# Altium project STM32F4x1-N40-EVAL.PrjPcb
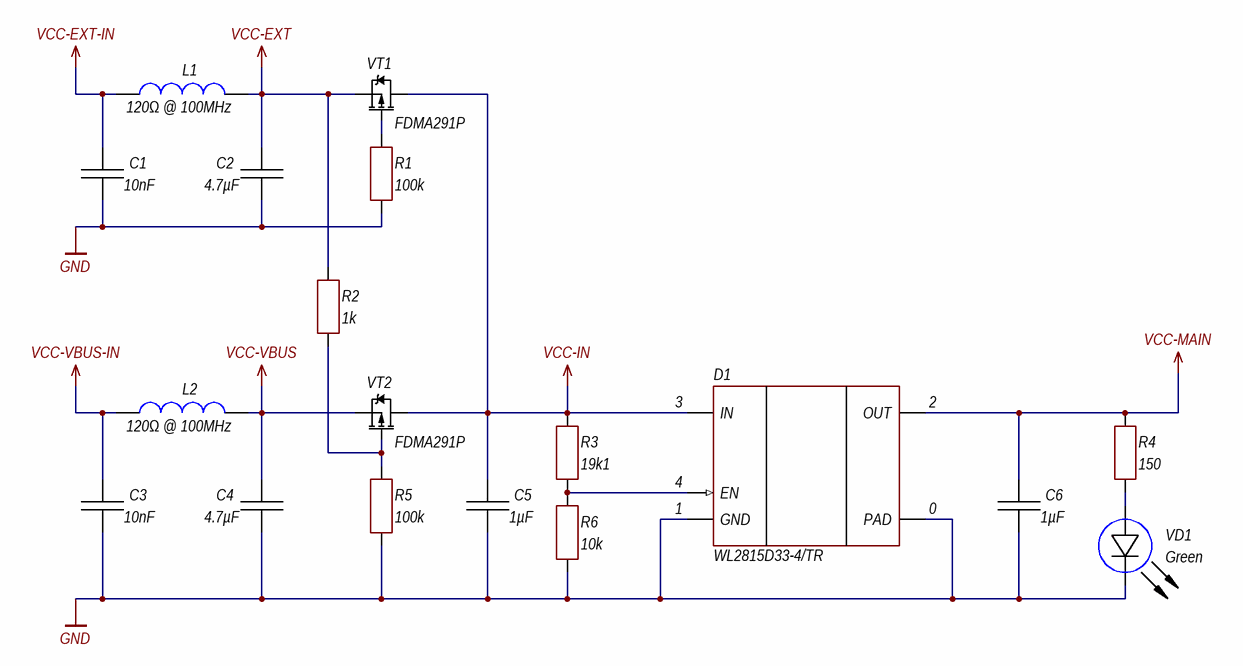
[diagram p0: Power Supply.SchDoc]
ProjectTitle: Eval board for STM32F4x1 MCU's in 48-UFQFPN package; ProjectShortDate: 2021.08; ProjectRevision: 0.1.5.1; ProjectNumber: STM32F411-N40-EVAL; ProjectDate: 29.08.2021; ProjectCompanyName: Azek Clark © 2021; ProjectAuthor: Clark A.
18 sheets, 167 parts. Net scope: flat (ports and power ports of the same name join across sheets).
Board file: PCB.PcbDoc
Sheets:
  Power Supply.SchDoc
  MCU-Power.SchDoc
  MCU-IO.SchDoc
  MCU-Debug.SchDoc
  GPIO-I2C.SchDoc
  GPIO-USB.SchDoc
  GPIO-SDIO.SchDoc
  GPIO-Debug.SchDoc
  USB-C-Control.SchDoc
  I2C-EEPROM.SchDoc
  I2C-Temp-sensor.SchDoc
  I2C-Motion-sensor.SchDoc
  I2C-Magnetometer-sensor.SchDoc
  Connector-Side-1.SchDoc
  Connector-Side-2.SchDoc
  Connector-USB.SchDoc
  Connector-SDCard.SchDoc
  LED&Button.SchDoc

## Sheet Power Supply.SchDoc: =ProjectTitle
size 297 x 209 mm; Author: Clark A.; CompanyName: Azek Clark © 2021; Address1: Address1; Address2: Address2; Address3: Address3; Address4: Address4; DocumentNumber: STM32F411-N40-EVAL-0.1.5.1; SheetNumber: 1; SheetTotal: 16; Scale: 1:1; DocumentType: Схема электрическая принципиальная; FirstReferrence: STM32F411-N40-EVAL

### Parts
C1  10nF  [CH0805CM]
C2  4.7µF  [CH0805CM]
C3  10nF  [CH0805CM]
C4  4.7µF  [CH0805CM]
C5  1µF  [CH0402C]
C6  1µF  [CH0402C]
D1  WL2815D33-4/TR  [DFN1010-4]
L1  120Ω @ 100MHz  [CH0805LM]
L2  120Ω @ 100MHz  [CH0805LM]
R1  100k  [CH0402R]
R2  1k  [CH0402R]
R3  19k1  [CH0402R]
R4  150  [CH0402R]
R5  100k  [CH0402R]
R6  10k  [CH0402R]
VD1  Green  [CH0402LG]
VT1  FDMA291P  [MicroFET 2x2]
VT2  FDMA291P  [MicroFET 2x2]

### Nets
GND: C1.1 C2.1 C3.1 C4.1 C5.1 C6.1 D1.0(PAD) D1.1(GND) R1.1 R5.1 R6.1 VD1.2(C)
VCC-EXT: C2.2 L1.1 R2.2 VT1.3(S)
VCC-EXT-IN: C1.2 L1.2
VCC-IN: C5.2 D1.3(IN) R3.2 VT1.2(D) VT2.2(D)
VCC-MAIN: C6.2 D1.2(OUT) R4.2
VCC-VBUS: C4.2 L2.1 VT2.3(S)
VCC-VBUS-IN: C3.2 L2.2
NetD1_4: D1.4(EN) R3.1 R6.2
NetR1_2: R1.2 VT1.1(G)
NetR2_1: R2.1 R5.2 VT2.1(G)
NetR4_1: R4.1 VD1.1(A)

### Notes on the sheet
- Утв.
- Н.контр.
- Т.контр.
- Пров.
- Разраб.
- Изм.
- Лист
- № докум.
- Подп.
- Дата
- Копировал
- Формат А4
- Лит.
- Листов
- Масса
- Масштаб

### Library data of the parts
C1-C6 = Capacitor: Manufacturer: *; Model: *; HelpURL: *; ComponentKind: *
  C1 C3: Value: 10nF
  C2 C4: Value: 4.7µF
  C5 C6: Value: 1µF
D1 = WL2815: LDO; Model: WL2815D33-4/TR; HelpURL: https://www.lcsc.com/product-detail/Linear-Voltage-Regulators-LDO_WILLSEMI-Will-Semicon-WL2815D33-4-TR_C506126.html; ComponentKind: DFN1010-4, 5.25V, 300mA
L1 L2 = Inductor: Manufacturer: *; Model: *; HelpURL: *; ComponentKind: *; Value: 120Ω @ 100MHz
R1-R6 = Resistor: Manufacturer: *; Model: *; HelpURL: *; ComponentKind: *
  R1 R5: Value: 100k
  R2: Value: 1k
  R3: Value: 19k1
  R4: Value: 150
  R6: Value: 10k
VD1 = LED: Manufacturer: *; Model: *; HelpURL: *; ComponentKind: *; Value: Green
VT1 VT2 = P-chanel: Mosfet; pin to pad: 1>3 2>1 3>2; Manufacturer: Fairchild Semiconductor; Model: FDMA291P; ComponentKind: -20V, -1V, 6.6A; HelpURL: https://www.chipdip.ru/product/fdma291p

## Sheet MCU-Power.SchDoc: =ProjectTitle
size 297 x 209 mm; Author: Clark A.; CompanyName: Azek Clark © 2021; Address1: Address1; Address2: Address2; Address3: Address3; Address4: Address4; DocumentNumber: STM32F411-N40-EVAL 0.1.5.1; SheetNumber: 2; SheetTotal: 16; Scale: 1:1; DocumentType: Схема электрическая принципиальная; FirstReferrence: STM32F411-N40-EVAL
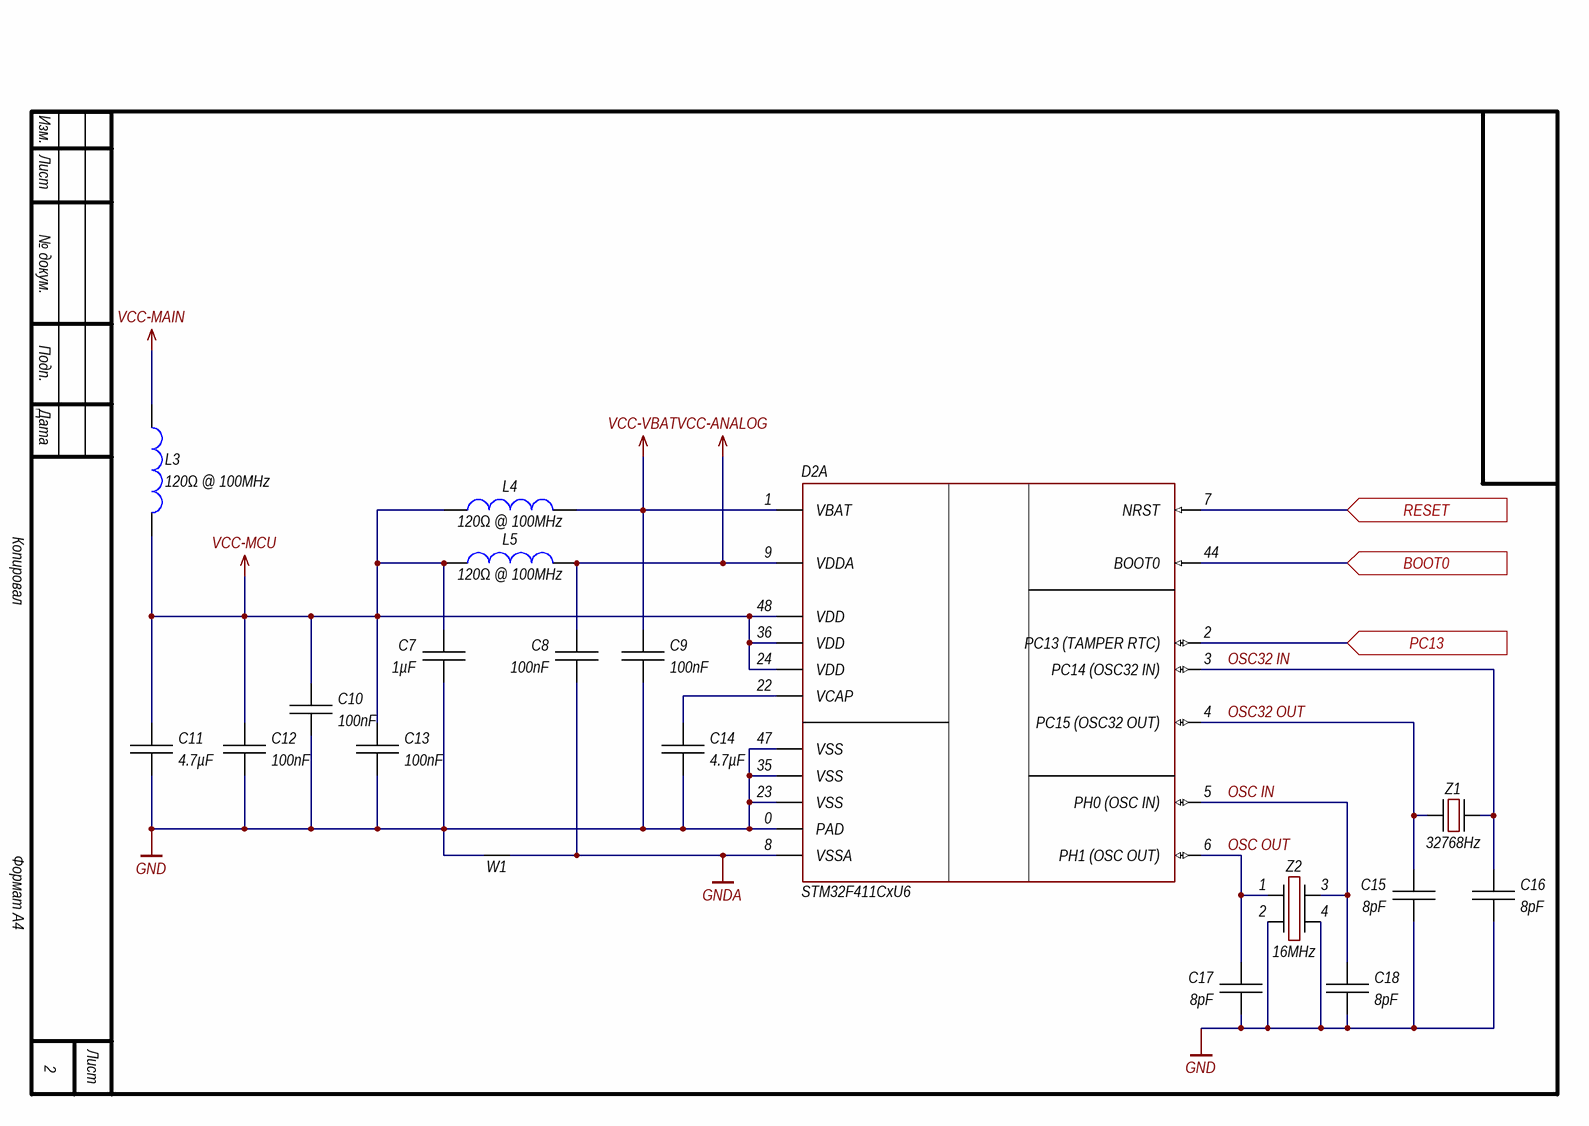
[diagram p1: MCU-Power.SchDoc]

### Parts
C7  1µF  [CH0402C]
C8  100nF  [CH0402C]
C9  100nF  [CH0402C]
C10  100nF  [CH0402C]
C11  4.7µF  [CH0402C]
C12  100nF  [CH0402C]
C13  100nF  [CH0402C]
C14  4.7µF  [CH0402C]
C15  8pF  [CH0402C]
C16  8pF  [CH0402C]
C17  8pF  [CH0402C]
C18  8pF  [CH0402C]
D2  STM32F411CxU6  [48-UFQFPN]  (part A of 2)
L3  120Ω @ 100MHz  [CH0402L]
L4  120Ω @ 100MHz  [CH0402L]
L5  120Ω @ 100MHz  [CH0402L]
W1  Net Tie  [CON: Net Tie 1.1x0.5]  (value not drawn)  (net tie, no BOM)
Z1  32768Hz  [OSC: 2012]
Z2  16MHz  [OSC: 2520]

### Ports
BOOT0 (in), PC13 (in), RESET (in)

### Nets
GND: C7.1 C9.1 C10.1 C11.1 C12.1 C13.1 C14.1 C15.1 C16.1 C17.1 C18.1 D2.0(PAD) D2.23(VSS) D2.35(VSS) D2.47(VSS) W1.1 Z2.2 Z2.4
GNDA: C8.1 D2.8(VSSA) W1.2
VCC-ANALOG: C8.2 D2.9(VDDA) L5.1
VCC-MAIN: L3.2
VCC-MCU: C7.2 C10.2 C11.2 C12.2 C13.2 D2.24(VDD) D2.36(VDD) D2.48(VDD) L3.1 L4.2 L5.2
VCC-VBAT: C9.2 D2.1(VBAT) L4.1
BOOT0: D2.44(BOOT0) ; port BOOT0
OSC32 IN: C16.2 D2.3(PC14_(OSC32_IN)) Z1.3
OSC32 OUT: C15.2 D2.4(PC15_(OSC32_OUT)) Z1.1
OSC IN: C18.2 D2.5(PH0_(OSC_IN)) Z2.3
OSC OUT: C17.2 D2.6(PH1_(OSC_OUT)) Z2.1
PC13: D2.2(PC13_(TAMPER_RTC)) ; port PC13
RESET: D2.7(NRST) ; port RESET
NetC14_2: C14.2 D2.22(VCAP)

### Notes on the sheet
- Изм.
- Лист
- № докум.
- Подп.
- Дата
- Копировал
- Формат А4

### Library data of the parts
C7-C18 = Capacitor: Manufacturer: *; Model: *; HelpURL: *; ComponentKind: *
  C7: Value: 1µF
  C8-C10 C12 C13: Value: 100nF
  C11 C14: Value: 4.7µF
  C15-C18: Value: 8pF
D2 = STM32F411CxU6: STM32, Cortex-M4; Manufacturer: ST Microelectronics; Model: STM32F411CxU6; ComponentKind: STM32, 2.0-3.6V, 48-UFQFPN; HelpURL: https://datasheet.lcsc.com/lcsc/2107091825_STMicroelectronics-STM32F411VCT6_C1339312.pdf
L3-L5 = Inductor: Manufacturer: *; Model: *; HelpURL: *; ComponentKind: *; Value: 120Ω @ 100MHz
Z1 = Oscillator: Manufacturer: *; Model: *; HelpURL: *; ComponentKind: *; Value: 32768Hz
Z2 = Generator: Manufacturer: *; Model: *; HelpURL: *; ComponentKind: *; Value: 16MHz

## Sheet MCU-IO.SchDoc: =ProjectTitle
size 297 x 209 mm; Author: Clark A.; CompanyName: Azek Clark © 2021; Address1: Address1; Address2: Address2; Address3: Address3; Address4: Address4; DocumentNumber: STM32F411-N40-EVAL 0.1.5.1; SheetNumber: 3; SheetTotal: 16; Scale: 1:1; DocumentType: Схема электрическая принципиальная; FirstReferrence: STM32F411-N40-EVAL
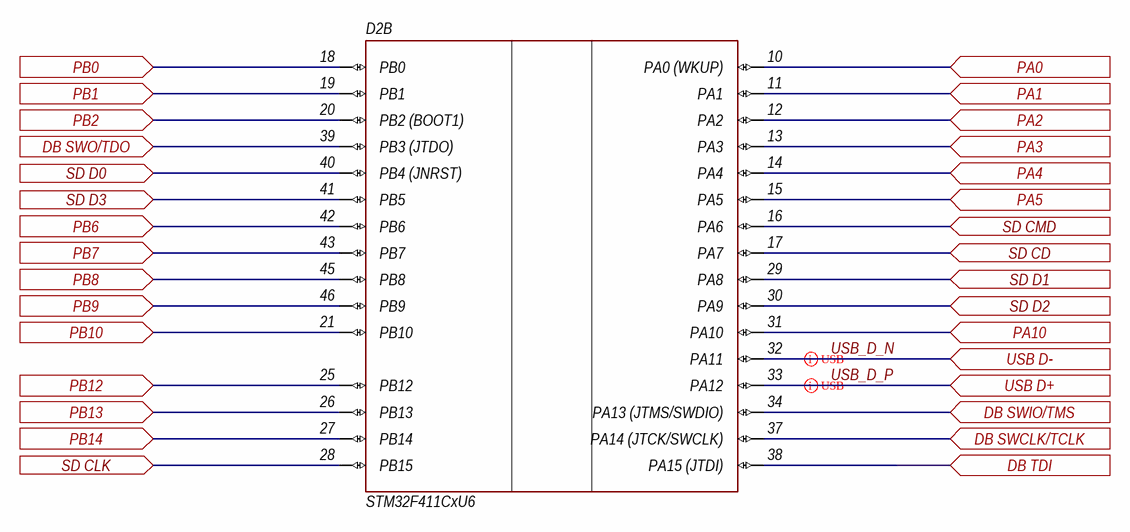
[diagram p2: MCU-IO.SchDoc]

### Parts
D2  STM32F411CxU6  [48-UFQFPN]  (part B of 2)

### Ports
DB SWCLK/TCLK (in), DB SWIO/TMS (in), DB SWO/TDO (in), DB TDI (in), PA0 (in), PA1 (in), PA2 (in), PA3 (in), PA4 (in), PA5 (in), PA10 (in), PB0 (in), PB1 (in), PB2 (in), PB6 (in), PB7 (in), PB8 (in), PB9 (in), PB10 (in), PB12 (in), PB13 (in), PB14 (in), SD CD (in), SD CLK (in), SD CMD (in), SD D0 (in), SD D1 (in), SD D2 (in), SD D3 (in), USB D+ (in), USB D- (in)

### Nets
DB SWCLK/TCLK: D2.37(PA14_(JTCK/SWCLK)) ; port DB SWCLK/TCLK
DB SWIO/TMS: D2.34(PA13_(JTMS/SWDIO)) ; port DB SWIO/TMS
DB SWO/TDO: D2.39(PB3_(JTDO)) ; port DB SWO/TDO
DB TDI: D2.38(PA15_(JTDI)) ; port DB TDI
PA0: D2.10(PA0_(WKUP)) ; port PA0
PA1: D2.11(PA1) ; port PA1
PA2: D2.12(PA2) ; port PA2
PA3: D2.13(PA3) ; port PA3
PA4: D2.14(PA4) ; port PA4
PA5: D2.15(PA5) ; port PA5
PA10: D2.31(PA10) ; port PA10
PB0: D2.18(PB0) ; port PB0
PB1: D2.19(PB1) ; port PB1
PB2: D2.20(PB2_(BOOT1)) ; port PB2
PB6: D2.42(PB6) ; port PB6
PB7: D2.43(PB7) ; port PB7
PB8: D2.45(PB8) ; port PB8
PB9: D2.46(PB9) ; port PB9
PB10: D2.21(PB10) ; port PB10
PB12: D2.25(PB12) ; port PB12
PB13: D2.26(PB13) ; port PB13
PB14: D2.27(PB14) ; port PB14
SD CD: D2.17(PA7) ; port SD CD
SD CLK: D2.28(PB15) ; port SD CLK
SD CMD: D2.16(PA6) ; port SD CMD
SD D0: D2.40(PB4_(JNRST)) ; port SD D0
SD D1: D2.29(PA8) ; port SD D1
SD D2: D2.30(PA9) ; port SD D2
SD D3: D2.41(PB5) ; port SD D3
USB_D_N: D2.32(PA11) ; port USB D-
USB_D_P: D2.33(PA12) ; port USB D+

### Layout directives
differential pair; differential pair class D90; rule Matched Net Lengths [Tolerance = 0.5mm]: USB_D_N, USB_D_P

### Notes on the sheet
- Изм.
- Лист
- № докум.
- Подп.
- Дата
- Копировал
- Формат А4

### Library data of the parts
D2 = STM32F411CxU6: as D2 on sheet MCU-Power; Model: STM32F411CxU6; ComponentKind: STM32, 2.0-3.6V, 48-UFQFPN; HelpURL: https://datasheet.lcsc.com/lcsc/2107091825_STMicroelectronics-STM32F411VCT6_C1339312.pdf

## Sheet MCU-Debug.SchDoc: =ProjectTitle
size 297 x 209 mm; Author: Clark A.; CompanyName: Azek Clark © 2021; Address1: Address1; Address2: Address2; Address3: Address3; Address4: Address4; DocumentNumber: STM32F411-N40-EVAL 0.1.5.1; SheetNumber: 4; SheetTotal: 16; Scale: 1:1; DocumentType: Схема электрическая принципиальная; FirstReferrence: STM32F411-N40-EVAL
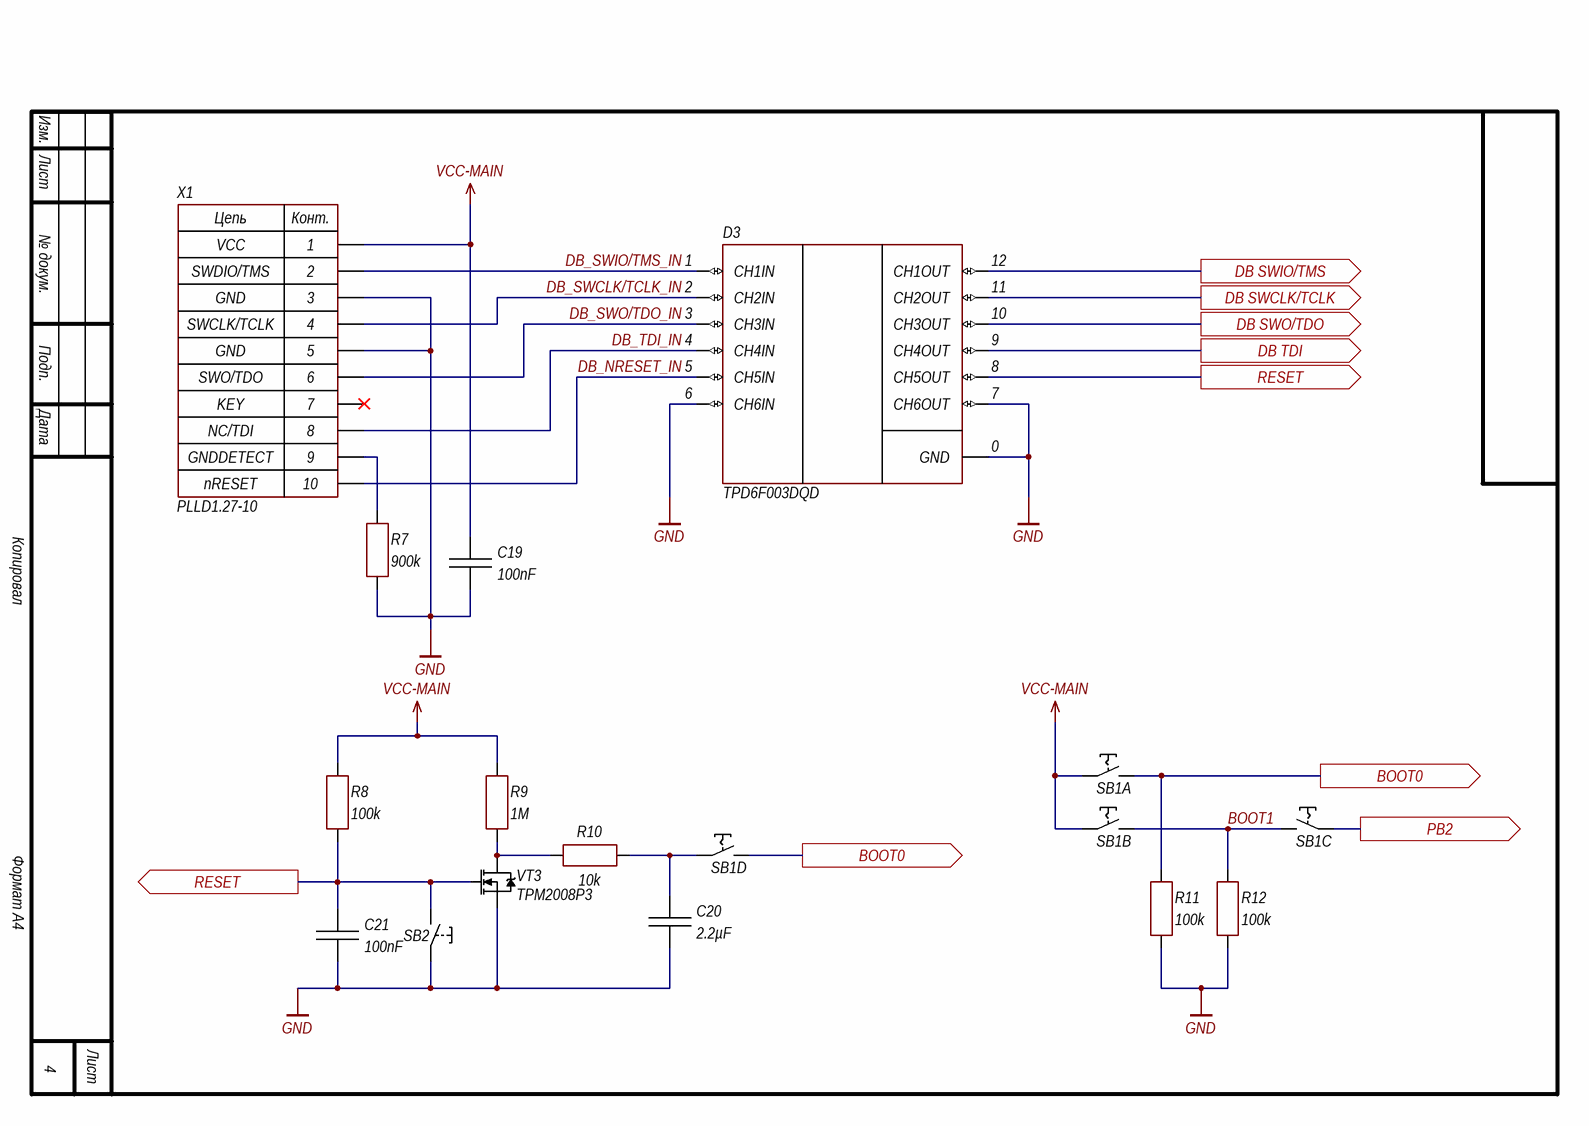
[diagram p3: MCU-Debug.SchDoc]

### Parts
C19  100nF  [CH0402C]
C20  2.2µF  [CH0402C]
C21  100nF  [CH0402C]
D3  TPD6F003DQD  [12-WSON (2.5x1.35 mm)]
R7  900k  [CH0402R]
R8  100k  [CH0402R]
R9  1M  [CH0402R]
R10  10k  [CH0402R]
R11  100k  [CH0402R]
R12  100k  [CH0402R]
SB1  *  [BUT: DSHP04TS]  (value not drawn)  (parts A,B,C,D of 4)
SB2  "Кнопка"  [BUT: YTS-A017]  (value not drawn)
VT3  TPM2008P3  [DFN1006-3L]
X1  PLLD1.27-10  [CON: PLLD-1.27-10]

### Ports
BOOT0 (out), DB SWCLK/TCLK (out), DB SWIO/TMS (out), DB SWO/TDO (out), DB TDI (out), PB2 (out), RESET (out)

### Nets
GND: C19.1 C20.1 C21.1 D3.0(GND) D3.6(CH6IN) D3.7(CH6OUT) R7.1 R11.1 R12.1 SB2.1 VT3.3(S) X1.3 X1.5
VCC-MAIN: C19.2 R8.2 R9.2 SB1.1 SB1.2 X1.1
BOOT0: R11.2 SB1.5 SB1.8 ; port BOOT0
BOOT1: R12.2 SB1.6 SB1.7
DB SWCLK/TCLK: D3.11(CH2OUT) ; port DB SWCLK/TCLK
DB SWIO/TMS: D3.12(CH1OUT) ; port DB SWIO/TMS
DB SWO/TDO: D3.10(CH3OUT) ; port DB SWO/TDO
DB TDI: D3.9(CH4OUT) ; port DB TDI
DB_NRESET_IN: D3.5(CH5IN) X1.10
DB_SWCLK/TCLK_IN: D3.2(CH2IN) X1.4
DB_SWIO/TMS_IN: D3.1(CH1IN) X1.2
DB_SWO/TDO_IN: D3.3(CH3IN) X1.6
DB_TDI_IN: D3.4(CH4IN) X1.8
PB2: SB1.3 ; port PB2
RESET: C21.2 D3.8(CH5OUT) R8.1 SB2.2 VT3.1(G) ; port RESET
NetC20_2: C20.2 R10.2 SB1.4
NetR7_2: R7.2 X1.9
NetR9_1: R9.1 R10.1 VT3.2(D)

Not connected (* = marked no-connect by the designer): X1 7*

### Notes on the sheet
- VCC
- SWDIO/TMS
- SWCLK/TCLK
- GND
- SWO/TDO
- KEY
- NC/TDI
- GNDDETECT
- nRESET
- Изм.
- Лист
- № докум.
- Подп.
- Дата
- Копировал
- Формат А4
- (in symbol 10-Connector) Цепь; Конт.

### Library data of the parts
C19-C21 = Capacitor: Manufacturer: *; Model: *; HelpURL: *; ComponentKind: *
  C19 C21: Value: 100nF
  C20: Value: 2.2µF
D3 = TPD6F003: 6-bit IO protection; Manufacturer: Texas Instruments; Model: TPD6F003DQD; ComponentKind: EMI Filter With Integrated ESD Protection; HelpURL: https://www.chipdip.ru/product0/8002872337
R7-R12 = Resistor: Manufacturer: *; Model: *; HelpURL: *; ComponentKind: *
  R7: Value: 900k
  R8 R11 R12: Value: 100k
  R9: Value: 1M
  R10: Value: 10k
SB1 = 4(1)-Switch: 4 Array, latching; Manufacturer: *; Model: *; HelpURL: *; ComponentKind: *
SB2 = 1-Button: Button, no latching; Manufacturer: *; Model: *; HelpURL: *; ComponentKind: *
VT3 = N-chanel: Mosfet; Manufacturer: TECH PUBLIC; Model: TPM2008P3; ComponentKind: 20V, 1.1V, 0.7A; HelpURL: https://www.lcsc.com/product-detail/MOSFETs_TECH-PUBLIC-TPM2008P3_C708974.html
X1 = 10-Connector: Model: PLLD1.27-10; Manufacturer: *; HelpURL: *; ComponentKind: *

## Sheet GPIO-I2C.SchDoc: =ProjectTitle
size 297 x 209 mm; Author: Clark A.; CompanyName: Azek Clark © 2021; Address1: Address1; Address2: Address2; Address3: Address3; Address4: Address4; DocumentNumber: STM32F411-N40-EVAL 0.1.5.1; SheetNumber: 5; SheetTotal: 16; Scale: 1:1; DocumentType: Схема электрическая принципиальная; FirstReferrence: STM32F411-N40-EVAL
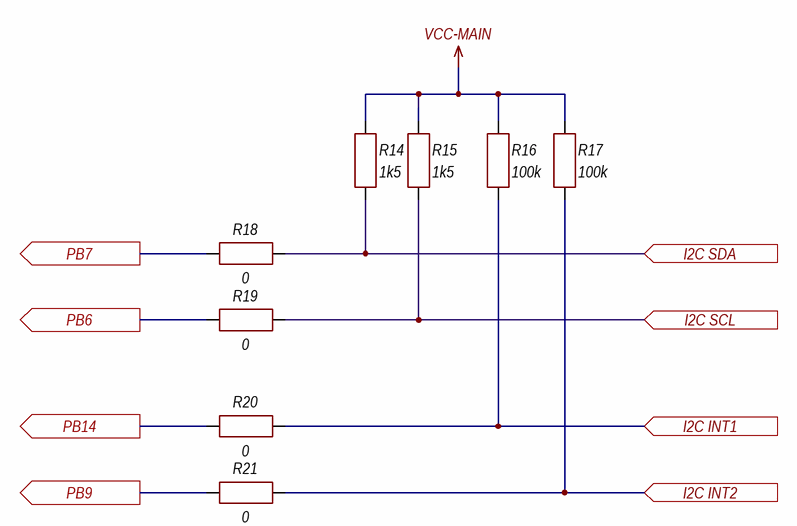
[diagram p4: GPIO-I2C.SchDoc]

### Parts
R14  1k5  [CH0402R]
R15  1k5  [CH0402R]
R16  100k  [CH0402R]
R17  100k  [CH0402R]
R18  0  [CH0402R]
R19  0  [CH0402R]
R20  0  [CH0402R]
R21  0  [CH0402R]

### Ports
I2C INT1 (in), I2C INT2 (in), I2C SCL (in), I2C SDA (in), PB6 (out), PB7 (out), PB9 (out), PB14 (out)

### Nets
VCC-MAIN: R14.2 R15.2 R16.2 R17.2
I2C INT1: R16.1 R20.2 ; port I2C INT1
I2C INT2: R17.1 R21.2 ; port I2C INT2
I2C SCL: R15.1 R19.2 ; port I2C SCL
I2C SDA: R14.1 R18.2 ; port I2C SDA
PB6: R19.1 ; port PB6
PB7: R18.1 ; port PB7
PB9: R21.1 ; port PB9
PB14: R20.1 ; port PB14

### Notes on the sheet
- Изм.
- Лист
- № докум.
- Подп.
- Дата
- Копировал
- Формат А4

### Library data of the parts
R14-R21 = Resistor: Manufacturer: *; Model: *; HelpURL: *; ComponentKind: *
  R14 R15: Value: 1k5
  R16 R17: Value: 100k
  R18-R21: Value: 0

## Sheet GPIO-USB.SchDoc: =ProjectTitle
size 297 x 209 mm; Author: Clark A.; CompanyName: Azek Clark © 2021; Address1: Address1; Address2: Address2; Address3: Address3; Address4: Address4; DocumentNumber: STM32F411-N40-EVAL 0.1.5.1; SheetNumber: 6; SheetTotal: 16; Scale: 1:1; DocumentType: Схема электрическая принципиальная; FirstReferrence: STM32F411-N40-EVAL
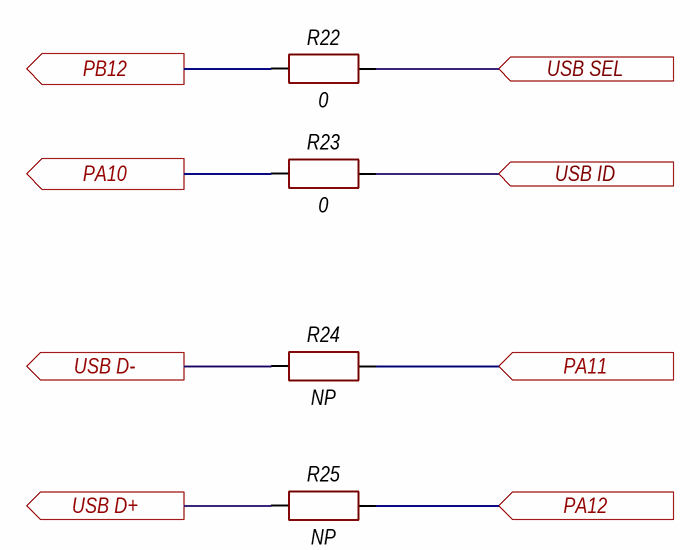
[diagram p5: GPIO-USB.SchDoc]

### Parts
R22  0  [CH0402R]
R23  0  [CH0402R]
R24  NP  [CH0402R]
R25  NP  [CH0402R]

### Ports
PA10 (out), PA11 (in), PA12 (in), PB12 (out), USB D+ (out), USB D- (out), USB ID (in), USB SEL (in)

### Nets
PA10: R23.1 ; port PA10
PA11: R24.2 ; port PA11
PA12: R25.2 ; port PA12
PB12: R22.1 ; port PB12
USB ID: R23.2 ; port USB ID
USB SEL: R22.2 ; port USB SEL
USB_D_N: R24.1 ; port USB D-
USB_D_P: R25.1 ; port USB D+

### Notes on the sheet
- Изм.
- Лист
- № докум.
- Подп.
- Дата
- Копировал
- Формат А4

### Library data of the parts
R22 R23 = Resistor: Manufacturer: *; Model: *; HelpURL: *; ComponentKind: *; Value: 0
R24 R25 = Resistor: Value: 0; Manufacturer: *; Model: *; HelpURL: *; ComponentKind: *; NP: NP

## Sheet GPIO-SDIO.SchDoc: =ProjectTitle
size 297 x 209 mm; Author: Clark A.; CompanyName: Azek Clark © 2021; Address1: Address1; Address2: Address2; Address3: Address3; Address4: Address4; DocumentNumber: STM32F411-N40-EVAL 0.1.5.1; SheetNumber: 7; SheetTotal: 16; Scale: 1:1; DocumentType: Схема электрическая принципиальная; FirstReferrence: STM32F411-N40-EVAL
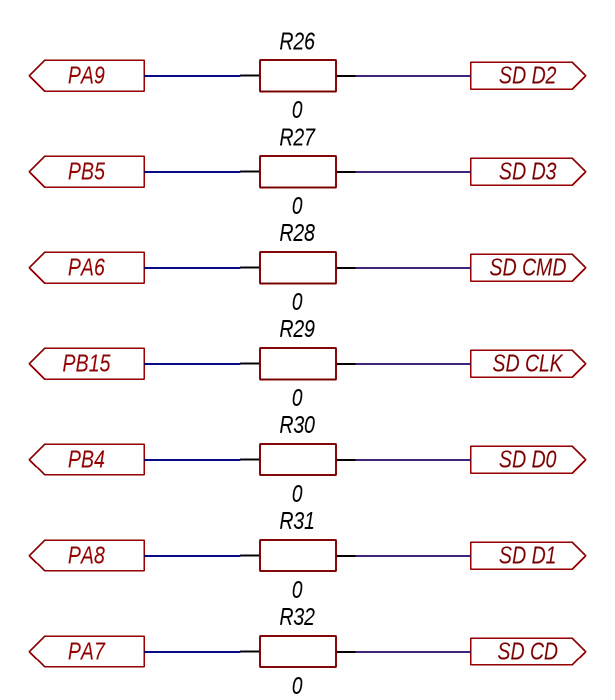
[diagram p6: GPIO-SDIO.SchDoc]

### Parts
R26  0  [CH0402R]
R27  0  [CH0402R]
R28  0  [CH0402R]
R29  0  [CH0402R]
R30  0  [CH0402R]
R31  0  [CH0402R]
R32  0  [CH0402R]

### Ports
PA6 (out), PA7 (out), PA8 (out), PA9 (out), PB4 (out), PB5 (out), PB15 (out), SD CD (out), SD CLK (out), SD CMD (out), SD D0 (out), SD D1 (out), SD D2 (out), SD D3 (out)

### Nets
PA6: R28.1 ; port PA6
PA7: R32.1 ; port PA7
PA8: R31.1 ; port PA8
PA9: R26.1 ; port PA9
PB4: R30.1 ; port PB4
PB5: R27.1 ; port PB5
PB15: R29.1 ; port PB15
SD CD: R32.2 ; port SD CD
SD CLK: R29.2 ; port SD CLK
SD CMD: R28.2 ; port SD CMD
SD D0: R30.2 ; port SD D0
SD D1: R31.2 ; port SD D1
SD D2: R26.2 ; port SD D2
SD D3: R27.2 ; port SD D3

### Notes on the sheet
- Изм.
- Лист
- № докум.
- Подп.
- Дата
- Копировал
- Формат А4

### Library data of the parts
R26-R32 = Resistor: Manufacturer: *; Model: *; HelpURL: *; ComponentKind: *; Value: 0

## Sheet GPIO-Debug.SchDoc: =ProjectTitle
size 297 x 209 mm; Author: Clark A.; CompanyName: Azek Clark © 2021; Address1: Address1; Address2: Address2; Address3: Address3; Address4: Address4; DocumentNumber: STM32F411-N40-EVAL 0.1.5.1; SheetNumber: 8; SheetTotal: 16; Scale: 1:1; DocumentType: Схема электрическая принципиальная; FirstReferrence: STM32F411-N40-EVAL
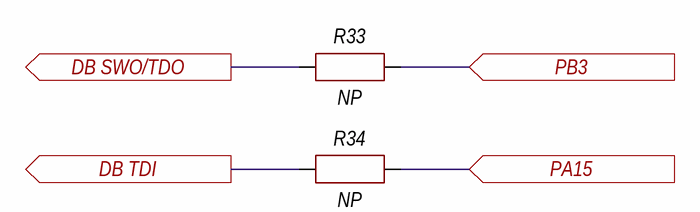
[diagram p7: GPIO-Debug.SchDoc]

### Parts
R33  NP  [CH0402R]
R34  NP  [CH0402R]

### Ports
DB SWO/TDO (out), DB TDI (out), PA15 (in), PB3 (in)

### Nets
DB SWO/TDO: R33.1 ; port DB SWO/TDO
DB TDI: R34.1 ; port DB TDI
PA15: R34.2 ; port PA15
PB3: R33.2 ; port PB3

### Notes on the sheet
- Изм.
- Лист
- № докум.
- Подп.
- Дата
- Копировал
- Формат А4

### Library data of the parts
R33 R34 = Resistor: Value: 0; Manufacturer: *; Model: *; HelpURL: *; ComponentKind: *; NP: NP

## Sheet USB-C-Control.SchDoc: =ProjectTitle
size 297 x 209 mm; Author: Clark A.; CompanyName: Azek Clark © 2021; Address1: Address1; Address2: Address2; Address3: Address3; Address4: Address4; DocumentNumber: STM32F411-N40-EVAL 0.1.5.1; SheetNumber: 9; SheetTotal: 17; Scale: 1:1; DocumentType: Схема электрическая принципиальная; FirstReferrence: STM32F411-N40-EVAL
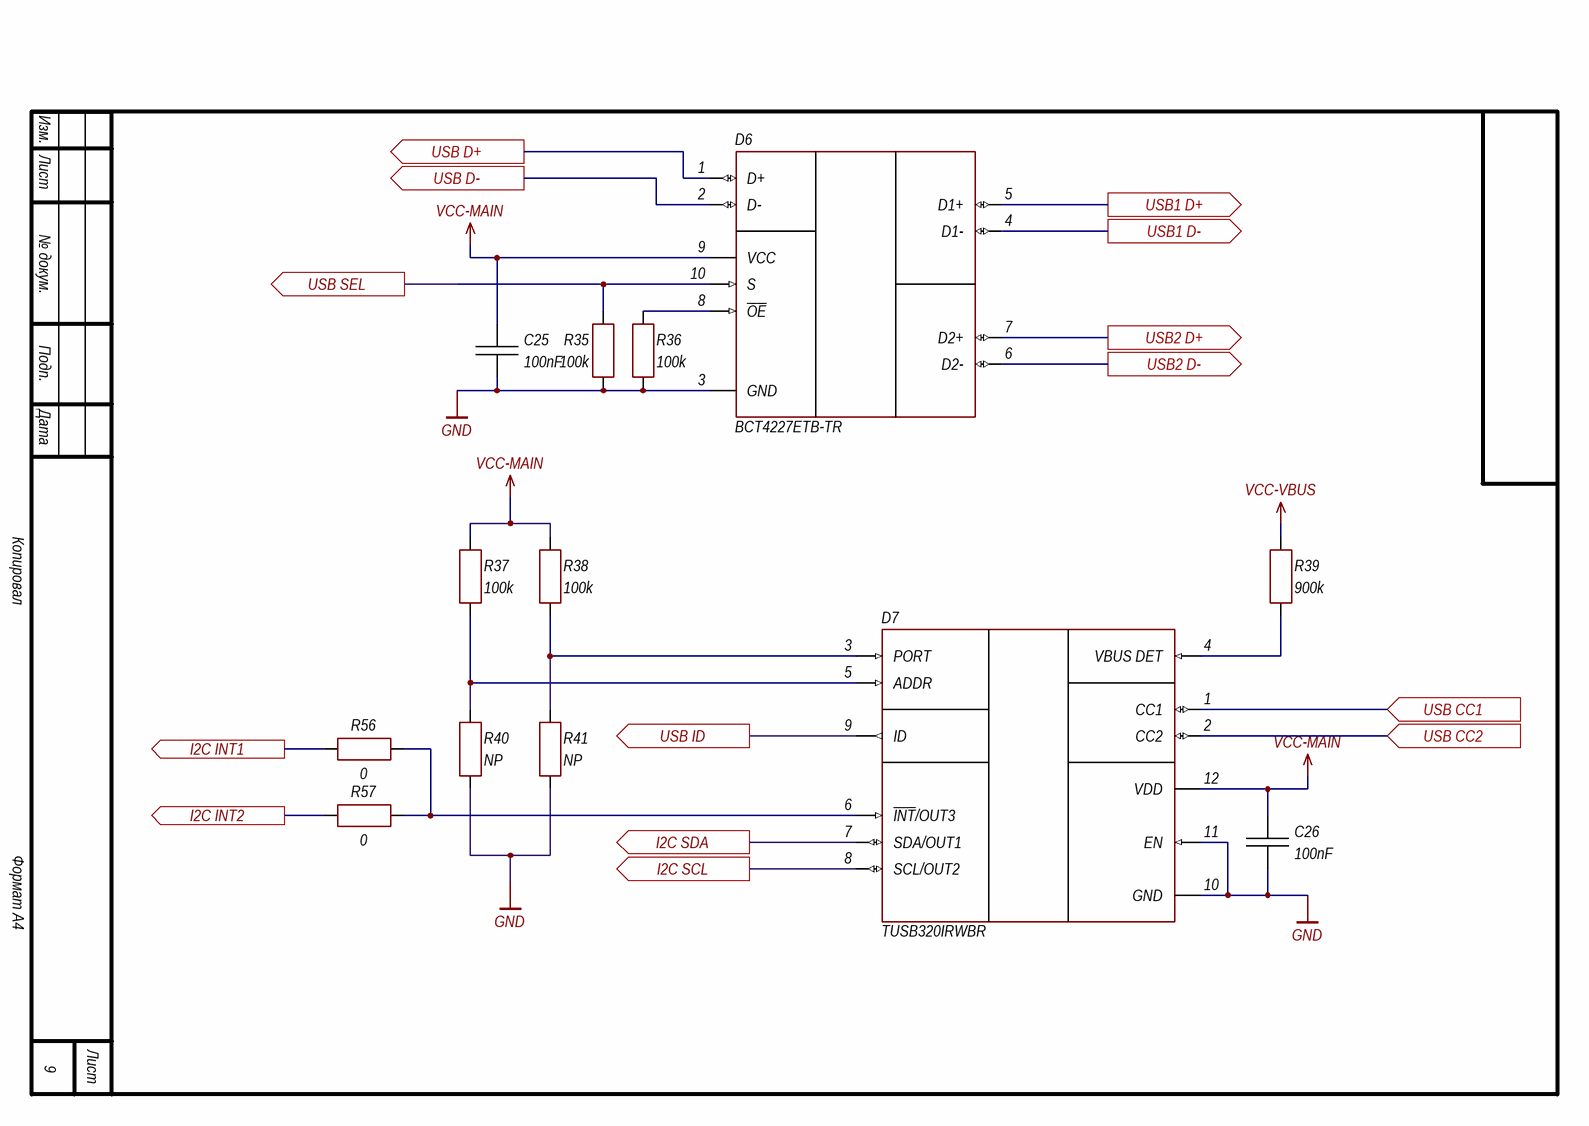
[diagram p8: USB-C-Control.SchDoc]

### Parts
C25  100nF  [CH0402C]
C26  100nF  [CH0402C]
D6  BCT4227ETB-TR  [10-UQFN]
D7  TUSB320IRWBR  [12-X2QFN]
R35  100k  [CH0402R]
R36  100k  [CH0402R]
R37  100k  [CH0402R]
R38  100k  [CH0402R]
R39  900k  [CH0402R]
R40  NP  [CH0402R]
R41  NP  [CH0402R]
R56  0  [CH0402R]
R57  0  [CH0402R]

### Ports
I2C INT1 (out), I2C INT2 (out), I2C SCL (out), I2C SDA (out), USB1 D+ (out), USB1 D- (out), USB2 D+ (out), USB2 D- (out), USB CC1 (in), USB CC2 (in), USB D+ (out), USB D- (out), USB ID (out), USB SEL (out)

### Nets
GND: C25.1 C26.1 D6.3(GND) D7.10(GND) D7.11(EN) R35.1 R36.1 R40.1 R41.1
VCC-MAIN: C25.2 C26.2 D6.9(VCC) D7.12(VDD) R37.2 R38.2
VCC-VBUS: R39.2
I2C INT1: R56.1 ; port I2C INT1
I2C INT2: R57.1 ; port I2C INT2
I2C SCL: D7.8(SCL/OUT2) ; port I2C SCL
I2C SDA: D7.7(SDA/OUT1) ; port I2C SDA
USB1_D_N: D6.4(D1-) ; port USB1 D-
USB1_D_P: D6.5(D1+) ; port USB1 D+
USB2_D_N: D6.6(D2-) ; port USB2 D-
USB2_D_P: D6.7(D2+) ; port USB2 D+
USB CC1: D7.1(CC1) ; port USB CC1
USB CC2: D7.2(CC2) ; port USB CC2
USB ID: D7.9(ID) ; port USB ID
USB SEL: D6.10(S) R35.2 ; port USB SEL
USB_D_N: D6.2(D-) ; port USB D-
USB_D_P: D6.1(D+) ; port USB D+
NetD6_8: D6.8(~{OE}) R36.2
NetD7_3: D7.3(PORT) R38.1 R41.2
NetD7_4: D7.4(VBUS_DET) R39.1
NetD7_5: D7.5(ADDR) R37.1 R40.2
NetD7_6: D7.6(~{INT}/OUT3) R56.2 R57.2

### Notes on the sheet
- Изм.
- Лист
- № докум.
- Подп.
- Дата
- Копировал
- Формат А4

### Library data of the parts
C25 C26 = Capacitor: Manufacturer: *; Model: *; HelpURL: *; ComponentKind: *; Value: 100nF
D6 = BCT4227ETB-TR: USB 2.0 1:2 Mux/Demux; Manufacturer: BROADCHIP; HelpURL: https://www.lcsc.com/product-detail/Analog-Switches_BROADCHIP-BCT4227ETB-TR_C266762.html; ComponentKind: USB 2.0 1:2 Mux/Demux; Model: BCT4227ETB-TR
D7 = TUSB320: USB-C Port I2C controller (USB OTG); Manufacturer: Texas Instruments; HelpURL: https://datasheet.lcsc.com/lcsc/1912111437_Texas-Instruments-TUSB320HAIRWBR_C414628.pdf; ComponentKind: USB-C Port I2C controller USB OTG; Model: TUSB320IRWBR
R35-R39 R56 R57 = Resistor: Manufacturer: *; Model: *; HelpURL: *; ComponentKind: *
  R35-R38: Value: 100k
  R39: Value: 900k
  R56 R57: Value: 0
R40 R41 = Resistor: Value: 100k; Manufacturer: *; Model: *; HelpURL: *; ComponentKind: *; NP: NP

## Sheet I2C-EEPROM.SchDoc: =ProjectTitle
size 297 x 209 mm; Author: Clark A.; CompanyName: Azek Clark © 2021; Address1: Address1; Address2: Address2; Address3: Address3; Address4: Address4; DocumentNumber: STM32F411-N40-EVAL 0.1.5.1; SheetNumber: 10; SheetTotal: 17; Scale: 1:1; DocumentType: Схема электрическая принципиальная; FirstReferrence: STM32F411-N40-EVAL
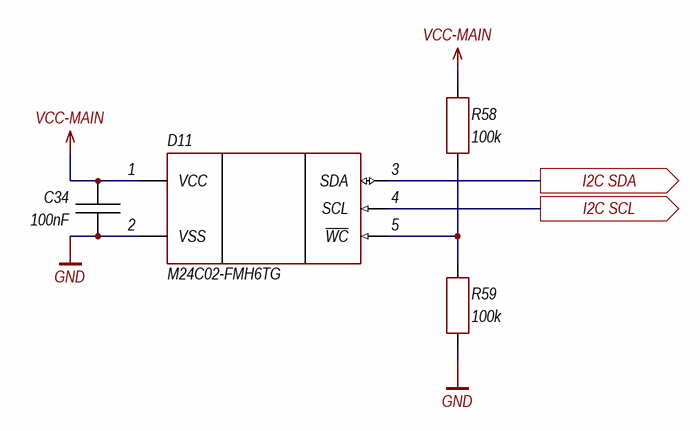
[diagram p9: I2C-EEPROM.SchDoc]

### Parts
C34  100nF  [CH0402C]
D11  M24C02-FMH6TG  [5-UFDFPN]
R58  100k  [CH0402R]
R59  100k  [CH0402R]

### Ports
I2C SCL (out), I2C SDA (out)

### Nets
GND: C34.1 D11.2(VSS) R59.1
VCC-MAIN: C34.2 D11.1(VCC) R58.2
I2C SCL: D11.4(SCL) ; port I2C SCL
I2C SDA: D11.3(SDA) ; port I2C SDA
NetD11_5: D11.5(~{WC}) R58.1 R59.2

### Notes on the sheet
- Изм.
- Лист
- № докум.
- Подп.
- Дата
- Копировал
- Формат А4

### Library data of the parts
C34 = Capacitor: Manufacturer: *; Model: *; HelpURL: *; ComponentKind: *; Value: 100nF
D11 = M24C0x-FMH6TG: EEPROM, I2C; Manufacturer: STMicroelectronics; Model: M24C02-FMH6TG; HelpURL: https://lcsc.com/product-detail/EEPROM_STMicroelectronics-M24C02-FMH6TG_C222197.html; ComponentKind: 1.8-5.5V, 256x8bit, I2C
R58 R59 = Resistor: Manufacturer: *; Model: *; HelpURL: *; ComponentKind: *; Value: 100k

## Sheet I2C-Temp-sensor.SchDoc: =ProjectTitle
size 297 x 209 mm; Author: Clark A.; CompanyName: Azek Clark © 2021; Address1: Address1; Address2: Address2; Address3: Address3; Address4: Address4; DocumentNumber: STM32F411-N40-EVAL 0.1.5.1; SheetNumber: 10; SheetTotal: 16; Scale: 1:1; DocumentType: Схема электрическая принципиальная; FirstReferrence: STM32F411-N40-EVAL
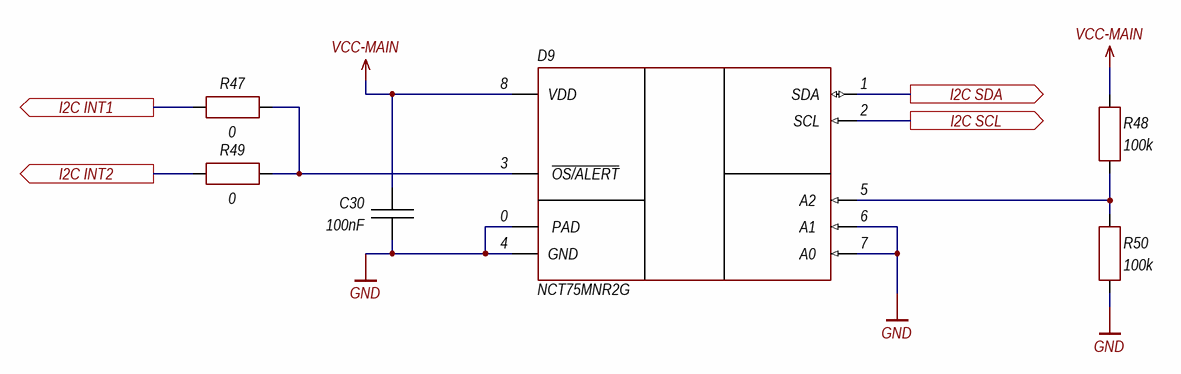
[diagram p10: I2C-Temp-sensor.SchDoc]

### Parts
C30  100nF  [CH0402C]
D9  NCT75MNR2G  [8-DFN (2x2 mm, 0.5mm pitch, EP)]
R47  0  [CH0402R]
R48  100k  [CH0402R]
R49  0  [CH0402R]
R50  100k  [CH0402R]

### Ports
I2C INT1 (out), I2C INT2 (out), I2C SCL (out), I2C SDA (out)

### Nets
GND: C30.1 D9.0(PAD) D9.4(GND) D9.6(A1) D9.7(A0) R50.1
VCC-MAIN: C30.2 D9.8(VDD) R48.2
I2C INT1: R47.1 ; port I2C INT1
I2C INT2: R49.1 ; port I2C INT2
I2C SCL: D9.2(SCL) ; port I2C SCL
I2C SDA: D9.1(SDA) ; port I2C SDA
NetD9_3: D9.3(~{OS/ALERT}) R47.2 R49.2
NetD9_5: D9.5(A2) R48.1 R50.2

### Notes on the sheet
- Изм.
- Лист
- № докум.
- Подп.
- Дата
- Копировал
- Формат А4

### Library data of the parts
C30 = Capacitor: Manufacturer: *; Model: *; HelpURL: *; ComponentKind: *; Value: 100nF
D9 = NCT75MNR2G: Temperature Sensor, I2C; Manufacturer: onsemi; Model: NCT75MNR2G; HelpURL: https://www.lcsc.com/product-detail/Temperature-Sensors_onsemi-NCT75MNR2G_C146741.html; ComponentKind: 3-5.5V, 12b, I2C
R47-R50 = Resistor: Manufacturer: *; Model: *; HelpURL: *; ComponentKind: *
  R47 R49: Value: 0
  R48 R50: Value: 100k

## Sheet I2C-Motion-sensor.SchDoc: =ProjectTitle
size 297 x 209 mm; Author: Clark A.; CompanyName: Azek Clark © 2021; Address1: Address1; Address2: Address2; Address3: Address3; Address4: Address4; DocumentNumber: STM32F411-N40-EVAL 0.1.5.1; SheetNumber: 12; SheetTotal: 17; Scale: 1:1; DocumentType: Схема электрическая принципиальная; FirstReferrence: STM32F411-N40-EVAL
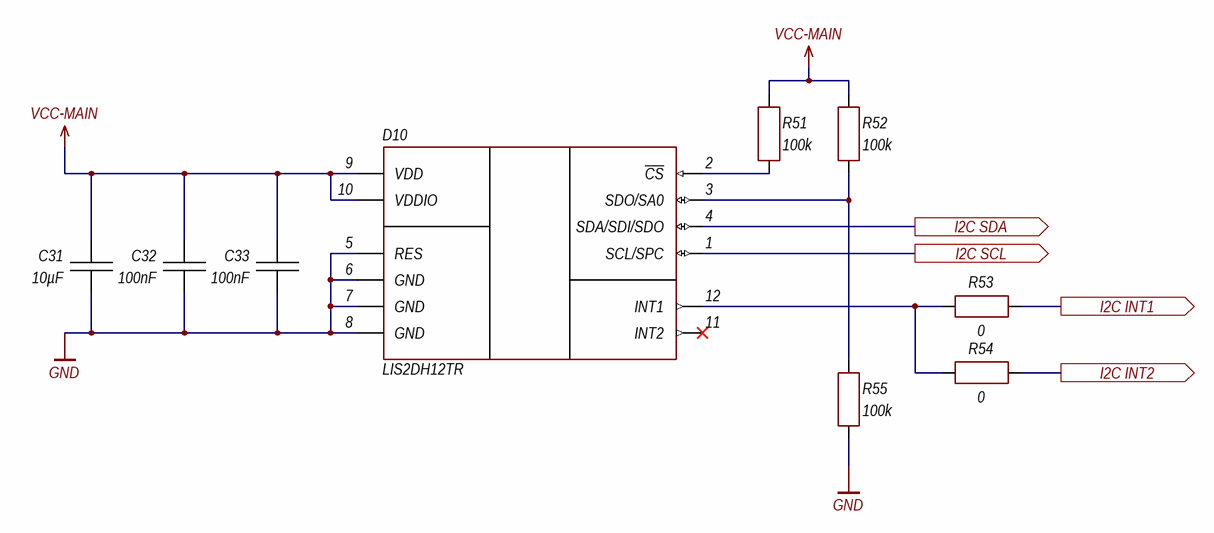
[diagram p11: I2C-Motion-sensor.SchDoc]

### Parts
C31  10µF  [CH0402C]
C32  100nF  [CH0402C]
C33  100nF  [CH0402C]
D10  LIS2DH12TR  [12-LGA (2x2mm)]
R51  100k  [CH0402R]
R52  100k  [CH0402R]
R53  0  [CH0402R]
R54  0  [CH0402R]
R55  100k  [CH0402R]

### Ports
I2C INT1 (out), I2C INT2 (out), I2C SCL (out), I2C SDA (out)

### Nets
GND: C31.1 C32.1 C33.1 D10.5(RES) D10.6(GND) D10.7(GND) D10.8(GND) R55.1
VCC-MAIN: C31.2 C32.2 C33.2 D10.9(VDD) D10.10(VDDIO) R51.2 R52.2
I2C INT1: R53.1 ; port I2C INT1
I2C INT2: R54.1 ; port I2C INT2
I2C SCL: D10.1(SCL/SPC) ; port I2C SCL
I2C SDA: D10.4(SDA/SDI/SDO) ; port I2C SDA
NetD10_2: D10.2(~{CS}) R51.1
NetD10_3: D10.3(SDO/SA0) R52.1 R55.2
NetD10_12: D10.12(INT1) R53.2 R54.2

Not connected (* = marked no-connect by the designer): D10 11(INT2)*

### Notes on the sheet
- Изм.
- Лист
- № докум.
- Подп.
- Дата
- Копировал
- Формат А4

### Library data of the parts
C31-C33 = Capacitor: Manufacturer: *; Model: *; HelpURL: *; ComponentKind: *
  C31: Value: 10µF
  C32 C33: Value: 100nF
D10 = LIS2DH12TR: Motion sensor, I2C; Manufacturer: STMicroelectronics; Model: LIS2DH12TR; HelpURL: https://www.lcsc.com/product-detail/Motion-Sensors-Accelerometers_STMicroelectronics-LIS2DH12TR_C110926.html; ComponentKind: 1.71-3.6V, 4D/6D,±2/4/8/16 g , I2C
R51-R55 = Resistor: Manufacturer: *; Model: *; HelpURL: *; ComponentKind: *
  R51 R52 R55: Value: 100k
  R53 R54: Value: 0

## Sheet I2C-Magnetometer-sensor.SchDoc: =ProjectTitle
size 297 x 209 mm; Author: Clark A.; CompanyName: Azek Clark © 2021; Address1: Address1; Address2: Address2; Address3: Address3; Address4: Address4; DocumentNumber: STM32F411-N40-EVAL 0.1.5.1; SheetNumber: 13; SheetTotal: 18; Scale: 1:1; DocumentType: Схема электрическая принципиальная; FirstReferrence: STM32F411-N40-EVAL
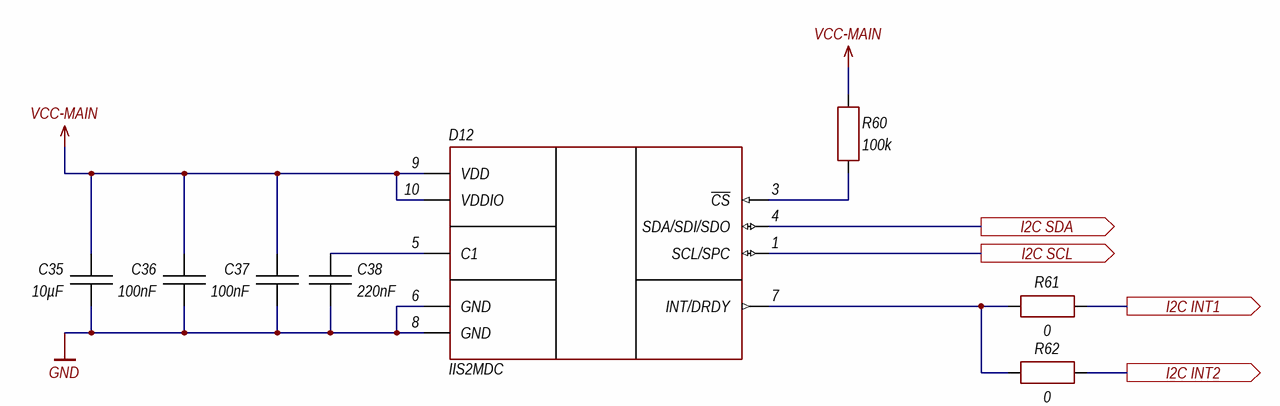
[diagram p12: I2C-Magnetometer-sensor.SchDoc]

### Parts
C35  10µF  [CH0402C]
C36  100nF  [CH0402C]
C37  100nF  [CH0402C]
C38  220nF  [CH0402C]
D12  IIS2MDC  [12-LGA (2x2mm)]
R60  100k  [CH0402R]
R61  0  [CH0402R]
R62  0  [CH0402R]

### Ports
I2C INT1 (out), I2C INT2 (out), I2C SCL (out), I2C SDA (out)

### Nets
GND: C35.1 C36.1 C37.1 C38.1 D12.6(GND) D12.8(GND)
VCC-MAIN: C35.2 C36.2 C37.2 D12.9(VDD) D12.10(VDDIO) R60.2
I2C INT1: R61.1 ; port I2C INT1
I2C INT2: R62.1 ; port I2C INT2
I2C SCL: D12.1(SCL/SPC) ; port I2C SCL
I2C SDA: D12.4(SDA/SDI/SDO) ; port I2C SDA
NetC38_2: C38.2 D12.5(C1)
NetD12_3: D12.3(~{CS}) R60.1
NetD12_7: D12.7(INT/DRDY) R61.2 R62.2

### Notes on the sheet
- Изм.
- Лист
- № докум.
- Подп.
- Дата
- Копировал
- Формат А4

### Library data of the parts
C35-C38 = Capacitor: Manufacturer: *; Model: *; HelpURL: *; ComponentKind: *
  C35: Value: 10µF
  C36 C37: Value: 100nF
  C38: Value: 220nF
D12 = IIS2MDC: 3-axis magnetometer, I2C/SPI; Manufacturer: STMicroelectronics; Model: IIS2MDC; HelpURL: https://lcsc.com/product-detail/Magnetic-Sensors_STMicroelectronics-IIS2MDCTR_C2655002.html; ComponentKind: 1.71-3.6V, X/Y/Z, ±50 gauss, I2C/SPI
R60-R62 = Resistor: Manufacturer: *; Model: *; HelpURL: *; ComponentKind: *
  R60: Value: 100k
  R61 R62: Value: 0

## Sheet Connector-Side-1.SchDoc: =ProjectTitle
size 297 x 209 mm; Author: Clark A.; CompanyName: Azek Clark © 2021; Address1: Address1; Address2: Address2; Address3: Address3; Address4: Address4; DocumentNumber: STM32F411-N40-EVAL 0.1.5.1; SheetNumber: 14; SheetTotal: 17; Scale: 1:1; DocumentType: Схема электрическая принципиальная; FirstReferrence: STM32F411-N40-EVAL
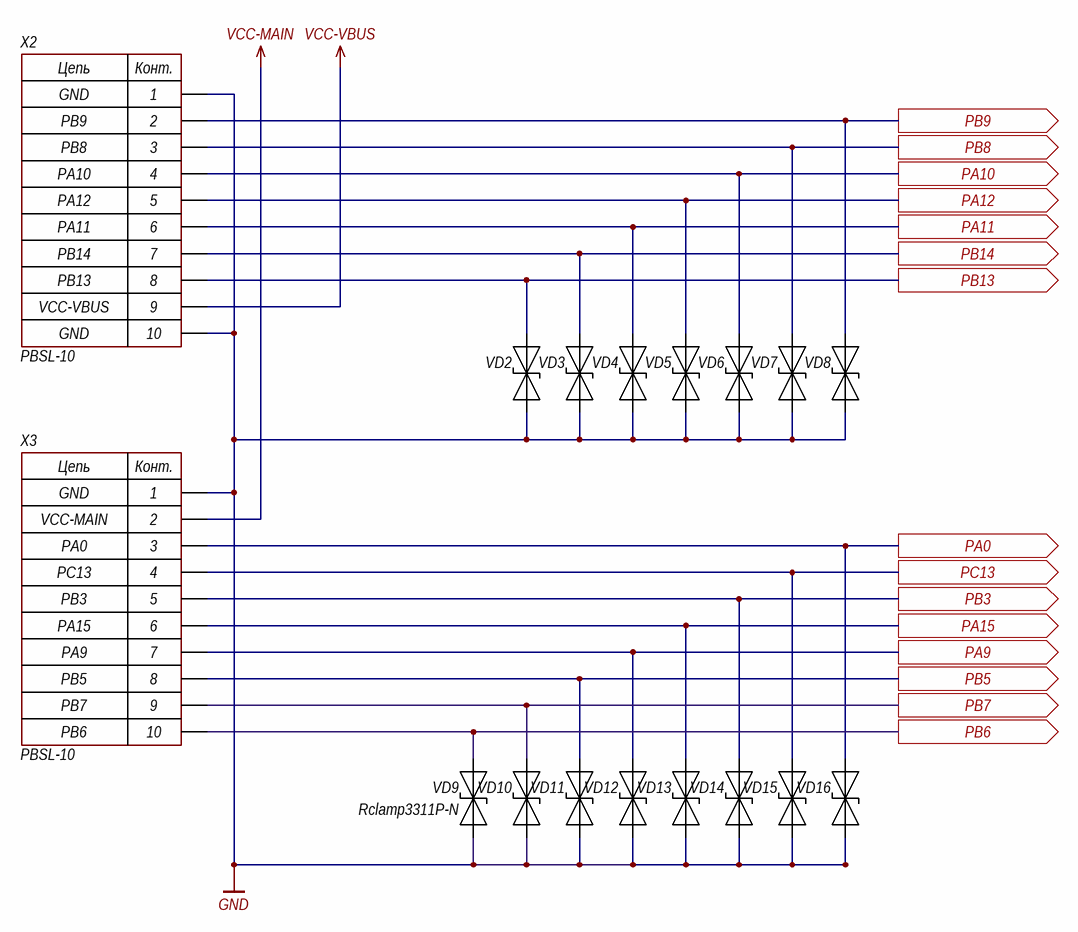
[diagram p13: Connector-Side-1.SchDoc]

### Parts
VD2  Rclamp3311P-N  [DFN1006-2]  (value not drawn)
VD3  Rclamp3311P-N  [DFN1006-2]  (value not drawn)
VD4  Rclamp3311P-N  [DFN1006-2]  (value not drawn)
VD5  Rclamp3311P-N  [DFN1006-2]  (value not drawn)
VD6  Rclamp3311P-N  [DFN1006-2]  (value not drawn)
VD7  Rclamp3311P-N  [DFN1006-2]  (value not drawn)
VD8  Rclamp3311P-N  [DFN1006-2]  (value not drawn)
VD9  Rclamp3311P-N  [DFN1006-2]
VD10  Rclamp3311P-N  [DFN1006-2]  (value not drawn)
VD11  Rclamp3311P-N  [DFN1006-2]  (value not drawn)
VD12  Rclamp3311P-N  [DFN1006-2]  (value not drawn)
VD13  Rclamp3311P-N  [DFN1006-2]  (value not drawn)
VD14  Rclamp3311P-N  [DFN1006-2]  (value not drawn)
VD15  Rclamp3311P-N  [DFN1006-2]  (value not drawn)
VD16  Rclamp3311P-N  [DFN1006-2]  (value not drawn)
X2  PBSL-10  [CON: PBSL-10]
X3  PBSL-10  [CON: PBSL-10]

### Ports
PA0 (out), PA9 (out), PA10 (out), PA11 (out), PA12 (out), PA15 (out), PB3 (out), PB5 (out), PB6 (out), PB7 (out), PB8 (out), PB9 (out), PB13 (out), PB14 (out), PC13 (out)

### Nets
GND: VD2.1(A) VD3.1(A) VD4.1(A) VD5.1(A) VD6.1(A) VD7.1(A) VD8.1(A) VD9.1(A) VD10.1(A) VD11.1(A) VD12.1(A) VD13.1(A) VD14.1(A) VD15.1(A) VD16.1(A) X2.1 X2.10 X3.1
VCC-MAIN: X3.2
VCC-VBUS: X2.9
PA0: VD16.2(C) X3.3 ; port PA0
PA9: VD12.2(C) X3.7 ; port PA9
PA10: VD6.2(C) X2.4 ; port PA10
PA11: VD4.2(C) X2.6 ; port PA11
PA12: VD5.2(C) X2.5 ; port PA12
PA15: VD13.2(C) X3.6 ; port PA15
PB3: VD14.2(C) X3.5 ; port PB3
PB5: VD11.2(C) X3.8 ; port PB5
PB6: VD9.2(C) X3.10 ; port PB6
PB7: VD10.2(C) X3.9 ; port PB7
PB8: VD7.2(C) X2.3 ; port PB8
PB9: VD8.2(C) X2.2 ; port PB9
PB13: VD2.2(C) X2.8 ; port PB13
PB14: VD3.2(C) X2.7 ; port PB14
PC13: VD15.2(C) X3.4 ; port PC13

### Notes on the sheet
- GND
- PB8
- PB9
- PA10
- PA12
- PA11
- PB13
- PB14
- VCC-VBUS
- VCC-MAIN
- PA0
- PC13
- PB3
- PA15
- PA9
- PB5
- PB6
- PB7
- Изм.
- Лист
- № докум.
- Подп.
- Дата
- Копировал
- Формат А4
- (in symbol 10-Connector) Цепь; Конт.

### Library data of the parts
VD2-VD16 = TVS-diod: Manufacturer: BORN; ComponentKind: 3.3V, 8V. 10A; Model: Rclamp3311P-N; HelpURL: https://www.lcsc.com/product-detail/ESD-Protection-Devices_BORN-Rclamp3311P-N_C406234.html
X2 X3 = 10-Connector: Model: PBSL-10; Manufacturer: *; HelpURL: *; ComponentKind: *

## Sheet Connector-Side-2.SchDoc: =ProjectTitle
size 297 x 209 mm; Author: Clark A.; CompanyName: Azek Clark © 2021; Address1: Address1; Address2: Address2; Address3: Address3; Address4: Address4; DocumentNumber: STM32F411-N40-EVAL 0.1.5.1; SheetNumber: 13; SheetTotal: 16; Scale: 1:1; DocumentType: Схема электрическая принципиальная; FirstReferrence: STM32F411-N40-EVAL
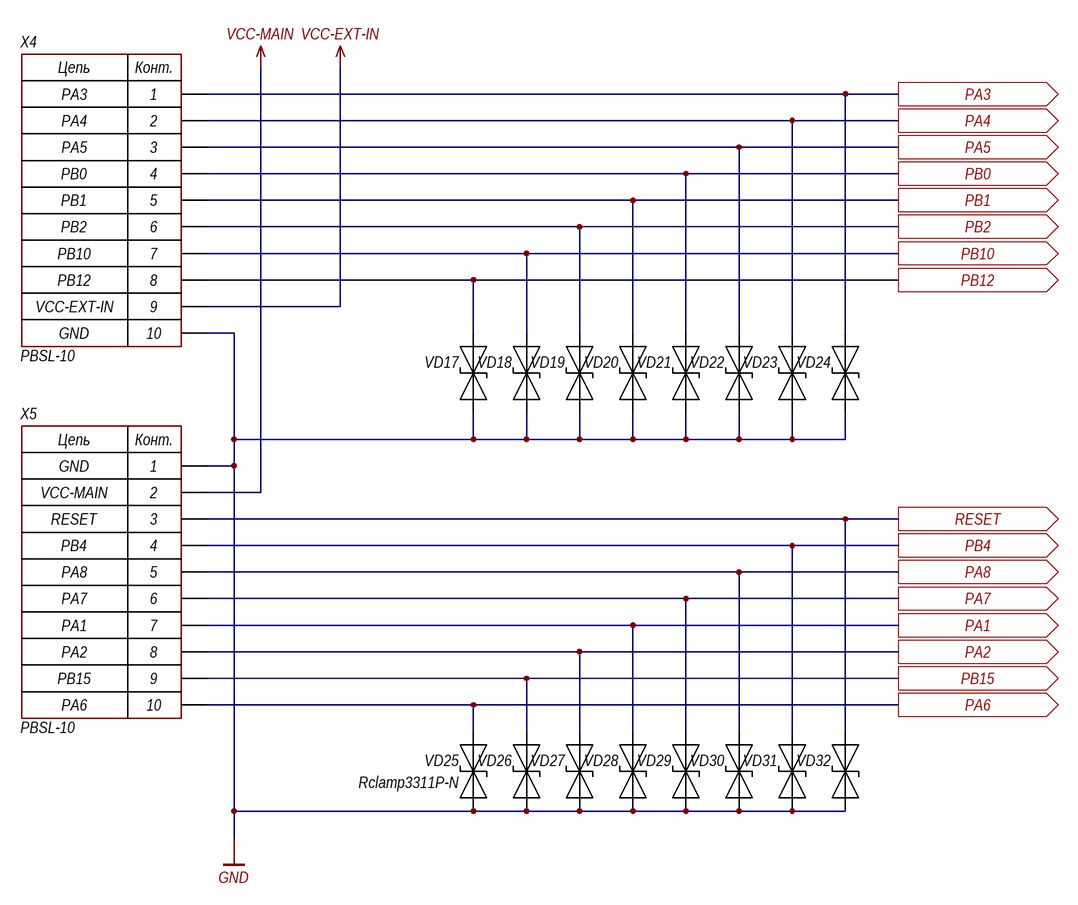
[diagram p14: Connector-Side-2.SchDoc]

### Parts
VD17  Rclamp3311P-N  [DFN1006-2]  (value not drawn)
VD18  Rclamp3311P-N  [DFN1006-2]  (value not drawn)
VD19  Rclamp3311P-N  [DFN1006-2]  (value not drawn)
VD20  Rclamp3311P-N  [DFN1006-2]  (value not drawn)
VD21  Rclamp3311P-N  [DFN1006-2]  (value not drawn)
VD22  Rclamp3311P-N  [DFN1006-2]  (value not drawn)
VD23  Rclamp3311P-N  [DFN1006-2]  (value not drawn)
VD24  Rclamp3311P-N  [DFN1006-2]  (value not drawn)
VD25  Rclamp3311P-N  [DFN1006-2]
VD26  Rclamp3311P-N  [DFN1006-2]  (value not drawn)
VD27  Rclamp3311P-N  [DFN1006-2]  (value not drawn)
VD28  Rclamp3311P-N  [DFN1006-2]  (value not drawn)
VD29  Rclamp3311P-N  [DFN1006-2]  (value not drawn)
VD30  Rclamp3311P-N  [DFN1006-2]  (value not drawn)
VD31  Rclamp3311P-N  [DFN1006-2]  (value not drawn)
VD32  Rclamp3311P-N  [DFN1006-2]  (value not drawn)
X4  PBSL-10  [CON: PBSL-10]
X5  PBSL-10  [CON: PBSL-10]

### Ports
PA1 (out), PA2 (out), PA3 (out), PA4 (out), PA5 (out), PA6 (out), PA7 (out), PA8 (out), PB0 (out), PB1 (out), PB2 (out), PB4 (out), PB10 (out), PB12 (out), PB15 (out), RESET (out)

### Nets
GND: VD17.1(A) VD18.1(A) VD19.1(A) VD20.1(A) VD21.1(A) VD22.1(A) VD23.1(A) VD24.1(A) VD25.1(A) VD26.1(A) VD27.1(A) VD28.1(A) VD29.1(A) VD30.1(A) VD31.1(A) VD32.1(A) X4.10 X5.1
VCC-EXT-IN: X4.9
VCC-MAIN: X5.2
PA1: VD28.2(C) X5.7 ; port PA1
PA2: VD27.2(C) X5.8 ; port PA2
PA3: VD24.2(C) X4.1 ; port PA3
PA4: VD23.2(C) X4.2 ; port PA4
PA5: VD22.2(C) X4.3 ; port PA5
PA6: VD25.2(C) X5.10 ; port PA6
PA7: VD29.2(C) X5.6 ; port PA7
PA8: VD30.2(C) X5.5 ; port PA8
PB0: VD21.2(C) X4.4 ; port PB0
PB1: VD20.2(C) X4.5 ; port PB1
PB2: VD19.2(C) X4.6 ; port PB2
PB4: VD31.2(C) X5.4 ; port PB4
PB10: VD18.2(C) X4.7 ; port PB10
PB12: VD17.2(C) X4.8 ; port PB12
PB15: VD26.2(C) X5.9 ; port PB15
RESET: VD32.2(C) X5.3 ; port RESET

### Notes on the sheet
- PA3
- PA4
- PB0
- PA5
- PB1
- PB2
- PB10
- PB12
- VCC-EXT-IN
- GND
- VCC-MAIN
- RESET
- PA7
- PA8
- PB4
- PA1
- PA2
- PA6
- PB15
- Изм.
- Лист
- № докум.
- Подп.
- Дата
- Копировал
- Формат А4
- (in symbol 10-Connector) Цепь; Конт.

### Library data of the parts
VD17-VD32 = TVS-diod: Manufacturer: BORN; ComponentKind: 3.3V, 8V. 10A; Model: Rclamp3311P-N; HelpURL: https://www.lcsc.com/product-detail/ESD-Protection-Devices_BORN-Rclamp3311P-N_C406234.html
X4 X5 = 10-Connector: Model: PBSL-10; Manufacturer: *; HelpURL: *; ComponentKind: *

## Sheet Connector-USB.SchDoc: =ProjectTitle
size 297 x 209 mm; Author: Clark A.; CompanyName: Azek Clark © 2021; Address1: Address1; Address2: Address2; Address3: Address3; Address4: Address4; DocumentNumber: STM32F411-N40-EVAL 0.1.5.1; SheetNumber: 14; SheetTotal: 16; Scale: 1:1; DocumentType: Схема электрическая принципиальная; FirstReferrence: STM32F411-N40-EVAL
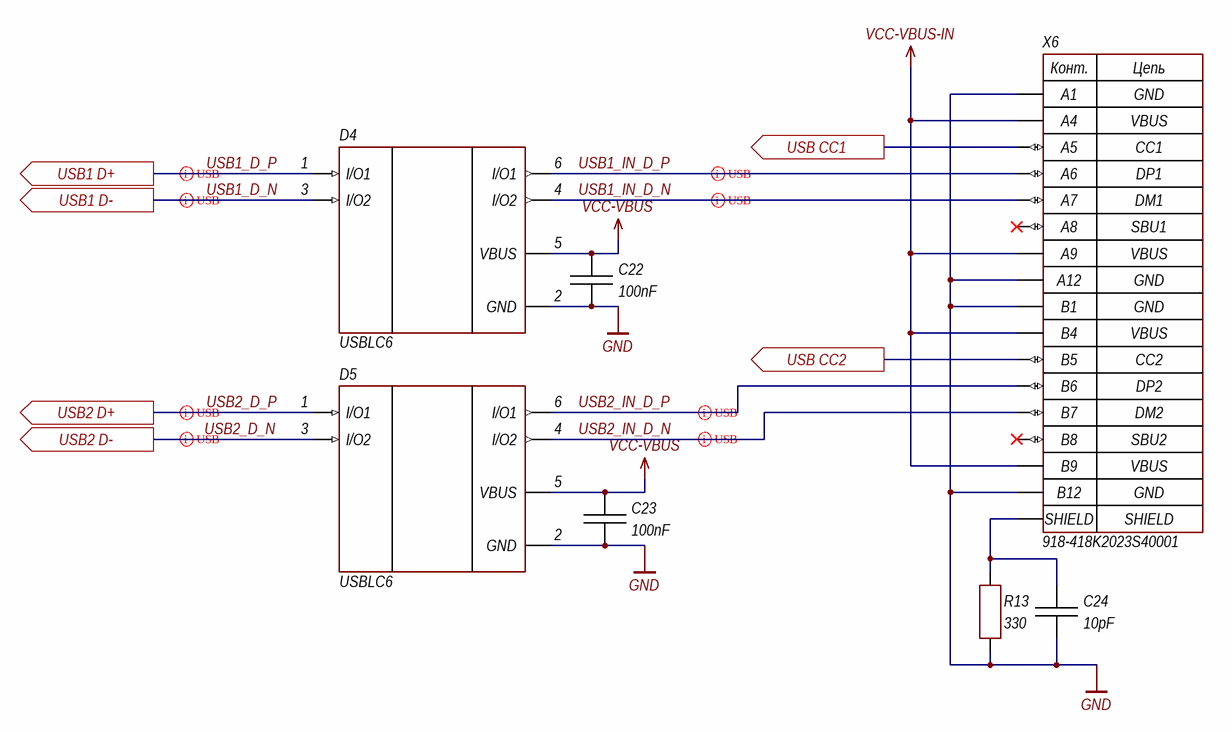
[diagram p15: Connector-USB.SchDoc]

### Parts
C22  100nF  [CH0402C]
C23  100nF  [CH0402C]
C24  10pF  [CH0402C]
D4  USBLC6  [SOT666]
D5  USBLC6  [SOT666]
R13  330  [CH0402R]
X6  918-418K2023S40001  [CON:  918-418K2023S40001]

### Ports
USB1 D+ (out), USB1 D- (out), USB2 D+ (out), USB2 D- (out), USB CC1 (out), USB CC2 (out)

### Nets
GND: C22.1 C23.1 C24.1 D4.2(GND) D5.2(GND) R13.1 X6.A1 X6.A12 X6.B1 X6.B12
VCC-VBUS: C22.2 C23.2 D4.5(VBUS) D5.5(VBUS)
VCC-VBUS-IN: X6.A4 X6.A9 X6.B4 X6.B9
USB1_D_N: D4.3(I/O2) ; port USB1 D-
USB1_D_P: D4.1(I/O1) ; port USB1 D+
USB1_IN_D_N: D4.4(I/O2) X6.A7
USB1_IN_D_P: D4.6(I/O1) X6.A6
USB2_D_N: D5.3(I/O2) ; port USB2 D-
USB2_D_P: D5.1(I/O1) ; port USB2 D+
USB2_IN_D_N: D5.4(I/O2) X6.B7
USB2_IN_D_P: D5.6(I/O1) X6.B6
USB CC1: X6.A5 ; port USB CC1
USB CC2: X6.B5 ; port USB CC2
NetC24_2: C24.2 R13.2 X6.SHIELD

Not connected (* = marked no-connect by the designer): X6 A8* B8*

### Layout directives
differential pair; differential pair class D90; rule Matched Net Lengths [Tolerance = 0.5mm]: USB1_D_N, USB1_D_P, USB1_IN_D_N, USB1_IN_D_P, USB2_D_N, USB2_D_P, USB2_IN_D_N, USB2_IN_D_P

### Notes on the sheet
- Изм.
- Лист
- № докум.
- Подп.
- Дата
- Копировал
- Формат А4
- (in symbol USB-C-12(16)) Конт.; Цепь; GND; VBUS; CC1; DP1; DM1; SBU1; CC2; DP2; DM2; SBU2

### Library data of the parts
C22-C24 = Capacitor: Manufacturer: *; Model: *; HelpURL: *; ComponentKind: *
  C22 C23: Value: 100nF
  C24: Value: 10pF
D4 D5 = USBLC6: USB protection; Manufacturer: STMicroelectronics; Model: USBLC6; ComponentKind: SOT23-6, SOT-666; HelpURL: https://www.digikey.com/product-detail/en/stmicroelectronics/USBLC6-2SC6Y/497-11882-1-ND/2756523
R13 = Resistor: Manufacturer: *; Model: *; HelpURL: *; ComponentKind: *; Value: 330
X6 = USB-C-12(16): USB-C 2.0 12(16)-pin; Model: 918-418K2023S40001; Manufacturer: *; HelpURL: *; ComponentKind: *

## Sheet Connector-SDCard.SchDoc: =ProjectTitle
size 297 x 209 mm; Author: Clark A.; CompanyName: Azek Clark © 2021; Address1: Address1; Address2: Address2; Address3: Address3; Address4: Address4; DocumentNumber: STM32F411-N40-EVAL 0.1.5.1; SheetNumber: 15; SheetTotal: 16; Scale: 1:1; DocumentType: Схема электрическая принципиальная; FirstReferrence: STM32F411-N40-EVAL
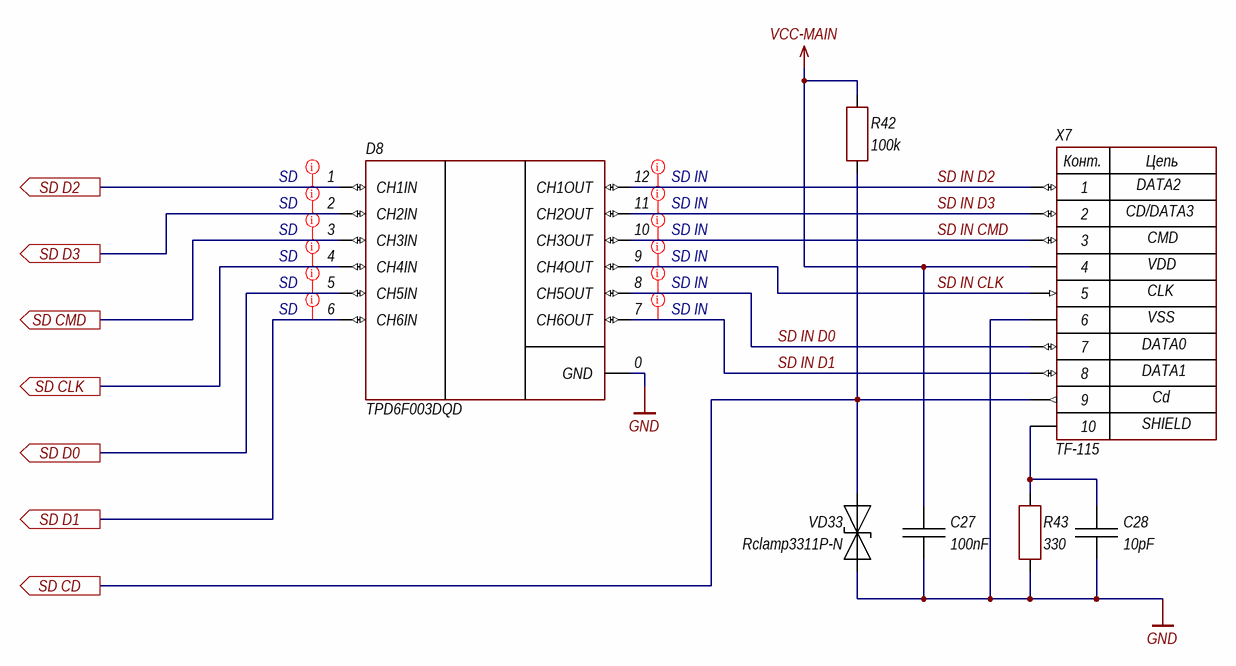
[diagram p16: Connector-SDCard.SchDoc]

### Parts
C27  100nF  [CH0402C]
C28  10pF  [CH0402C]
D8  TPD6F003DQD  [12-WSON (2.5x1.35 mm)]
R42  100k  [CH0402R]
R43  330  [CH0402R]
VD33  Rclamp3311P-N  [DFN1006-2]
X7  TF-115  [CON: MicroSD 14x15mm]

### Ports
SD CD (out), SD CLK (out), SD CMD (out), SD D0 (out), SD D1 (out), SD D2 (out), SD D3 (out)

### Nets
GND: C27.1 C28.1 D8.0(GND) R43.1 VD33.1(A) X7.6
VCC-MAIN: C27.2 R42.2 X7.4
SD CD: R42.1 VD33.2(C) X7.9 ; port SD CD
SD CLK: D8.4(CH4IN) ; port SD CLK
SD CMD: D8.3(CH3IN) ; port SD CMD
SD D0: D8.5(CH5IN) ; port SD D0
SD D1: D8.6(CH6IN) ; port SD D1
SD D2: D8.1(CH1IN) ; port SD D2
SD D3: D8.2(CH2IN) ; port SD D3
SD IN CLK: D8.9(CH4OUT) X7.5
SD IN CMD: D8.10(CH3OUT) X7.3
SD IN D0: D8.8(CH5OUT) X7.7
SD IN D1: D8.7(CH6OUT) X7.8
SD IN D2: D8.12(CH1OUT) X7.1
SD IN D3: D8.11(CH2OUT) X7.2
NetC28_2: C28.2 R43.2 X7.10

### Layout directives
net class SD IN; rule Matched Net Lengths [Tolerance = 2.54mm]: SD IN CLK, SD IN CMD, SD IN D0, SD IN D1, SD IN D2, SD IN D3
net class SD; rule Matched Net Lengths [Tolerance = 2.54mm]: SD CLK, SD CMD, SD D0, SD D1, SD D2, SD D3

### Notes on the sheet
- Изм.
- Лист
- № докум.
- Подп.
- Дата
- Копировал
- Формат А4
- (in symbol MicroSD) Конт.; Цепь; DATA2; CD/DATA3; CMD; VDD; CLK; VSS; DATA0; DATA1; Cd; SHIELD

### Library data of the parts
C27 C28 = Capacitor: Manufacturer: *; Model: *; HelpURL: *; ComponentKind: *
  C27: Value: 100nF
  C28: Value: 10pF
D8 = TPD6F003: as D3 on sheet MCU-Debug; Model: TPD6F003DQD; ComponentKind: EMI Filter With Integrated ESD Protection; HelpURL: https://www.chipdip.ru/product0/8002872337
R42 R43 = Resistor: Manufacturer: *; Model: *; HelpURL: *; ComponentKind: *
  R42: Value: 100k
  R43: Value: 330
VD33 = TVS-diod: Manufacturer: BORN; ComponentKind: 3.3V, 8V. 10A; Model: Rclamp3311P-N; HelpURL: https://www.lcsc.com/product-detail/ESD-Protection-Devices_BORN-Rclamp3311P-N_C406234.html
X7 = MicroSD: µSD connector; Manufacturer: XUNPU; Model: TF-115; HelpURL: https://www.lcsc.com/product-detail/Card-Sockets-Connectors_XUNPU-TF-115_C266620.html; ComponentKind: µSD Connector

## Sheet LED&Button.SchDoc: =ProjectTitle
size 297 x 209 mm; Author: Clark A.; CompanyName: Azek Clark © 2021; Address1: Address1; Address2: Address2; Address3: Address3; Address4: Address4; DocumentNumber: STM32F411-N40-EVAL 0.1.5.1; SheetNumber: 16; SheetTotal: 16; Scale: 1:1; DocumentType: Схема электрическая принципиальная; FirstReferrence: STM32F411-N40-EVAL
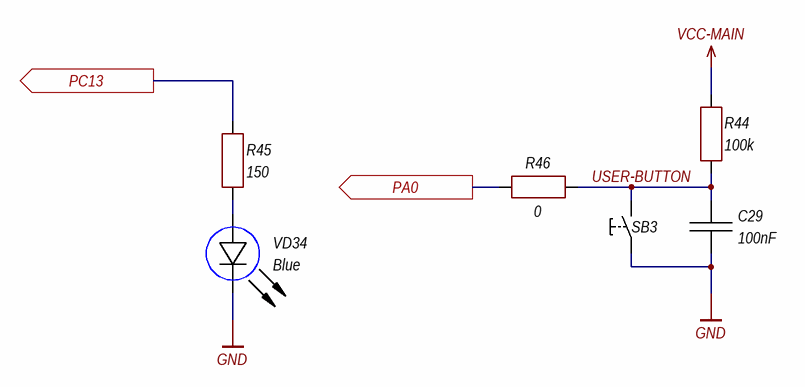
[diagram p17: LED&Button.SchDoc]

### Parts
C29  100nF  [CH0402C]
R44  100k  [CH0402R]
R45  150  [CH0402R]
R46  0  [CH0402R]
SB3  "Кнопка"  [BUT: YTS-A017]  (value not drawn)
VD34  Blue  [CH0402LG]

### Ports
PA0 (out), PC13 (out)

### Nets
GND: C29.1 SB3.1 VD34.2(C)
VCC-MAIN: R44.2
PA0: R46.1 ; port PA0
PC13: R45.2 ; port PC13
USER-BUTTON: C29.2 R44.1 R46.2 SB3.2
NetR45_1: R45.1 VD34.1(A)

### Notes on the sheet
- Изм.
- Лист
- № докум.
- Подп.
- Дата
- Копировал
- Формат А4

### Library data of the parts
C29 = Capacitor: Manufacturer: *; Model: *; HelpURL: *; ComponentKind: *; Value: 100nF
R44-R46 = Resistor: Manufacturer: *; Model: *; HelpURL: *; ComponentKind: *
  R44: Value: 100k
  R45: Value: 150
  R46: Value: 0
SB3 = 1-Button: Button, no latching; Manufacturer: *; Model: *; HelpURL: *; ComponentKind: *
VD34 = LED: Manufacturer: *; Model: *; HelpURL: *; ComponentKind: *; Value: Blue

## Nets that join several sheets
GND: Power Supply (12 pins), MCU-Power (18 pins), MCU-Debug (13 pins), USB-C-Control (9 pins), I2C-EEPROM (C34.1 D11.2 R59.1), I2C-Temp-sensor (6 pins), I2C-Motion-sensor (8 pins), I2C-Magnetometer-sensor (6 pins), Connector-Side-1 (18 pins), Connector-Side-2 (18 pins), Connector-USB (10 pins), Connector-SDCard (6 pins), LED&Button (C29.1 SB3.1 VD34.2)
VCC-EXT-IN: Power Supply (C1.2 L1.2), Connector-Side-2 (X4.9)
VCC-MAIN: Power Supply (C6.2 D1.2 R4.2), MCU-Power (L3.2), MCU-Debug (6 pins), GPIO-I2C (R14.2 R15.2 R16.2 R17.2), USB-C-Control (6 pins), I2C-EEPROM (C34.2 D11.1 R58.2), I2C-Temp-sensor (C30.2 D9.8 R48.2), I2C-Motion-sensor (7 pins), I2C-Magnetometer-sensor (6 pins), Connector-Side-1 (X3.2), Connector-Side-2 (X5.2), Connector-SDCard (C27.2 R42.2 X7.4), LED&Button (R44.2)
VCC-VBUS: Power Supply (C4.2 L2.1 VT2.3), USB-C-Control (R39.2), Connector-Side-1 (X2.9), Connector-USB (C22.2 C23.2 D4.5 D5.5)
VCC-VBUS-IN: Power Supply (C3.2 L2.2), Connector-USB (X6.A4 X6.A9 X6.B4 X6.B9)
BOOT0: MCU-Power (D2.44), MCU-Debug (R11.2 SB1.5 SB1.8)
DB SWCLK/TCLK: MCU-IO (D2.37), MCU-Debug (D3.11)
DB SWIO/TMS: MCU-IO (D2.34), MCU-Debug (D3.12)
DB SWO/TDO: MCU-IO (D2.39), MCU-Debug (D3.10), GPIO-Debug (R33.1)
DB TDI: MCU-IO (D2.38), MCU-Debug (D3.9), GPIO-Debug (R34.1)
I2C INT1: GPIO-I2C (R16.1 R20.2), USB-C-Control (R56.1), I2C-Temp-sensor (R47.1), I2C-Motion-sensor (R53.1), I2C-Magnetometer-sensor (R61.1)
I2C INT2: GPIO-I2C (R17.1 R21.2), USB-C-Control (R57.1), I2C-Temp-sensor (R49.1), I2C-Motion-sensor (R54.1), I2C-Magnetometer-sensor (R62.1)
I2C SCL: GPIO-I2C (R15.1 R19.2), USB-C-Control (D7.8), I2C-EEPROM (D11.4), I2C-Temp-sensor (D9.2), I2C-Motion-sensor (D10.1), I2C-Magnetometer-sensor (D12.1)
I2C SDA: GPIO-I2C (R14.1 R18.2), USB-C-Control (D7.7), I2C-EEPROM (D11.3), I2C-Temp-sensor (D9.1), I2C-Motion-sensor (D10.4), I2C-Magnetometer-sensor (D12.4)
PA0: MCU-IO (D2.10), Connector-Side-1 (VD16.2 X3.3), LED&Button (R46.1)
PA1: MCU-IO (D2.11), Connector-Side-2 (VD28.2 X5.7)
PA2: MCU-IO (D2.12), Connector-Side-2 (VD27.2 X5.8)
PA3: MCU-IO (D2.13), Connector-Side-2 (VD24.2 X4.1)
PA4: MCU-IO (D2.14), Connector-Side-2 (VD23.2 X4.2)
PA5: MCU-IO (D2.15), Connector-Side-2 (VD22.2 X4.3)
PA6: GPIO-SDIO (R28.1), Connector-Side-2 (VD25.2 X5.10)
PA7: GPIO-SDIO (R32.1), Connector-Side-2 (VD29.2 X5.6)
PA8: GPIO-SDIO (R31.1), Connector-Side-2 (VD30.2 X5.5)
PA9: GPIO-SDIO (R26.1), Connector-Side-1 (VD12.2 X3.7)
PA10: MCU-IO (D2.31), GPIO-USB (R23.1), Connector-Side-1 (VD6.2 X2.4)
PA11: GPIO-USB (R24.2), Connector-Side-1 (VD4.2 X2.6)
PA12: GPIO-USB (R25.2), Connector-Side-1 (VD5.2 X2.5)
PA15: GPIO-Debug (R34.2), Connector-Side-1 (VD13.2 X3.6)
PB0: MCU-IO (D2.18), Connector-Side-2 (VD21.2 X4.4)
PB1: MCU-IO (D2.19), Connector-Side-2 (VD20.2 X4.5)
PB2: MCU-IO (D2.20), MCU-Debug (SB1.3), Connector-Side-2 (VD19.2 X4.6)
PB3: GPIO-Debug (R33.2), Connector-Side-1 (VD14.2 X3.5)
PB4: GPIO-SDIO (R30.1), Connector-Side-2 (VD31.2 X5.4)
PB5: GPIO-SDIO (R27.1), Connector-Side-1 (VD11.2 X3.8)
PB6: MCU-IO (D2.42), GPIO-I2C (R19.1), Connector-Side-1 (VD9.2 X3.10)
PB7: MCU-IO (D2.43), GPIO-I2C (R18.1), Connector-Side-1 (VD10.2 X3.9)
PB8: MCU-IO (D2.45), Connector-Side-1 (VD7.2 X2.3)
PB9: MCU-IO (D2.46), GPIO-I2C (R21.1), Connector-Side-1 (VD8.2 X2.2)
PB10: MCU-IO (D2.21), Connector-Side-2 (VD18.2 X4.7)
PB12: MCU-IO (D2.25), GPIO-USB (R22.1), Connector-Side-2 (VD17.2 X4.8)
PB13: MCU-IO (D2.26), Connector-Side-1 (VD2.2 X2.8)
PB14: MCU-IO (D2.27), GPIO-I2C (R20.1), Connector-Side-1 (VD3.2 X2.7)
PB15: GPIO-SDIO (R29.1), Connector-Side-2 (VD26.2 X5.9)
PC13: MCU-Power (D2.2), Connector-Side-1 (VD15.2 X3.4), LED&Button (R45.2)
RESET: MCU-Power (D2.7), MCU-Debug (5 pins), Connector-Side-2 (VD32.2 X5.3)
SD CD: MCU-IO (D2.17), GPIO-SDIO (R32.2), Connector-SDCard (R42.1 VD33.2 X7.9)
SD CLK: MCU-IO (D2.28), GPIO-SDIO (R29.2), Connector-SDCard (D8.4)
SD CMD: MCU-IO (D2.16), GPIO-SDIO (R28.2), Connector-SDCard (D8.3)
SD D0: MCU-IO (D2.40), GPIO-SDIO (R30.2), Connector-SDCard (D8.5)
SD D1: MCU-IO (D2.29), GPIO-SDIO (R31.2), Connector-SDCard (D8.6)
SD D2: MCU-IO (D2.30), GPIO-SDIO (R26.2), Connector-SDCard (D8.1)
SD D3: MCU-IO (D2.41), GPIO-SDIO (R27.2), Connector-SDCard (D8.2)
USB1_D_N: USB-C-Control (D6.4), Connector-USB (D4.3)
USB1_D_P: USB-C-Control (D6.5), Connector-USB (D4.1)
USB2_D_N: USB-C-Control (D6.6), Connector-USB (D5.3)
USB2_D_P: USB-C-Control (D6.7), Connector-USB (D5.1)
USB CC1: USB-C-Control (D7.1), Connector-USB (X6.A5)
USB CC2: USB-C-Control (D7.2), Connector-USB (X6.B5)
USB ID: GPIO-USB (R23.2), USB-C-Control (D7.9)
USB SEL: GPIO-USB (R22.2), USB-C-Control (D6.10 R35.2)
USB_D_N: MCU-IO (D2.32), GPIO-USB (R24.1), USB-C-Control (D6.2)
USB_D_P: MCU-IO (D2.33), GPIO-USB (R25.1), USB-C-Control (D6.1)